# Altium project NAVIGATION.PrjPcb (part 1 of 2)
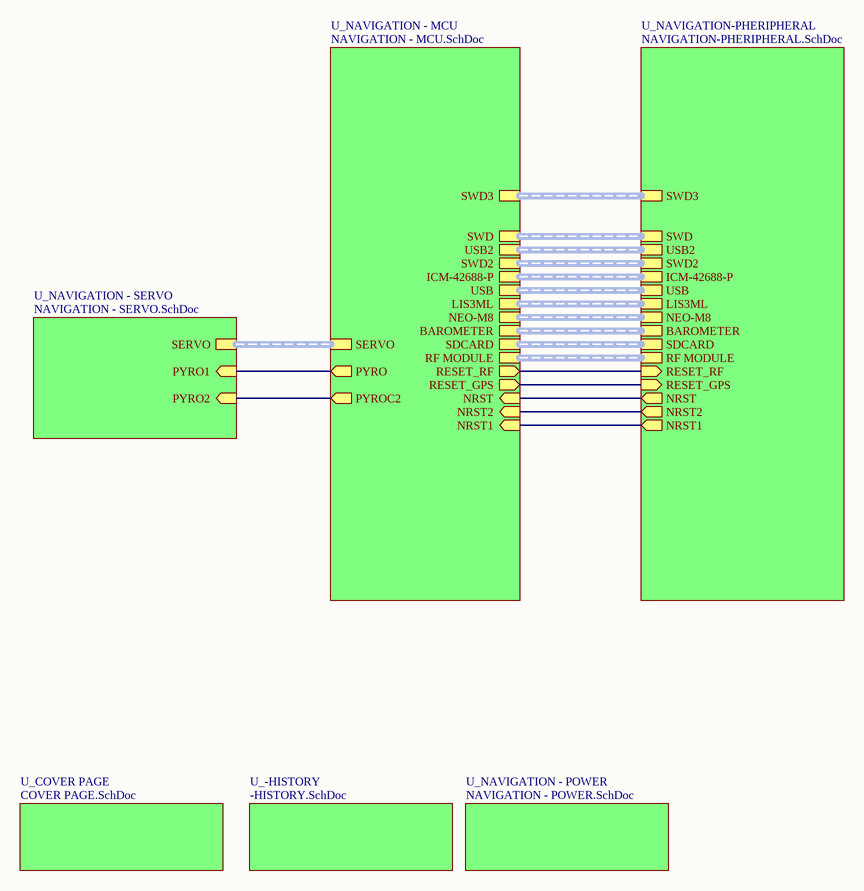
[diagram p0: OVERVIEW.SchDoc]
7 sheets, 251 parts. Net scope: hierarchical (ports join the sheet entries above them; power ports are global).
Board file: NAVIGATION.PcbDoc
Sheets:
  OVERVIEW.SchDoc
    U_COVER PAGE = COVER PAGE.SchDoc
    U_NAVIGATION - POWER = NAVIGATION - POWER.SchDoc
    U_NAVIGATION - MCU = NAVIGATION - MCU.SchDoc
    U_-HISTORY = -HISTORY.SchDoc
    U_NAVIGATION-PHERIPHERAL = NAVIGATION-PHERIPHERAL.SchDoc
    U_NAVIGATION - SERVO = NAVIGATION - SERVO.SchDoc

## Sheet OVERVIEW.SchDoc
size A4; SheetNumber: 1; SheetTotal: 7

### Sub-sheets
U_-HISTORY = -HISTORY.SchDoc: no entries
U_COVER PAGE = COVER PAGE.SchDoc: no entries
U_NAVIGATION - MCU = NAVIGATION - MCU.SchDoc: SWD (harness JTAG), USB2 (harness USB2), SWD2 (harness JTAG2), ICM-42688-P (harness ICM-42688-P), USB (harness USB), LIS3ML (harness LIS3ML), NEO-M8 (harness NEO-M8), BAROMETER (harness BAROMETER), SDCARD (harness SDCARD), RF MODULE (harness RF MODULE), SERVO (harness SERVO), RESET_RF (out), RESET_GPS (out), NRST (in), SWD3 (harness JTAG3), NRST1 (in), NRST2 (in), PYRO (out), PYROC2 (out)
U_NAVIGATION - POWER = NAVIGATION - POWER.SchDoc: no entries
U_NAVIGATION - SERVO = NAVIGATION - SERVO.SchDoc: SERVO (harness SERVO), PYRO1 (in), PYRO2 (in)
U_NAVIGATION-PHERIPHERAL = NAVIGATION-PHERIPHERAL.SchDoc: NRST (out), USB (harness USB), RF MODULE (harness RF MODULE), USB2 (harness USB2), BAROMETER (harness BAROMETER), SDCARD (harness SDCARD), RESET_GPS (in), ICM-42688-P (harness ICM-42688-P), RESET_RF (in), SWD2 (harness JTAG2), LIS3ML (harness LIS3ML), SWD (harness JTAG), NEO-M8 (harness NEO-M8), NRST2 (out), SWD3 (harness JTAG2), NRST1 (out)

### Nets
NRST: sheet U_NAVIGATION - MCU/NRST, sheet U_NAVIGATION-PHERIPHERAL/NRST
NRST1: sheet U_NAVIGATION - MCU/NRST1, sheet U_NAVIGATION-PHERIPHERAL/NRST1
NRST2: sheet U_NAVIGATION - MCU/NRST2, sheet U_NAVIGATION-PHERIPHERAL/NRST2
PYRO: sheet U_NAVIGATION - MCU/PYRO, sheet U_NAVIGATION - SERVO/PYRO1
PYROC2: sheet U_NAVIGATION - MCU/PYROC2, sheet U_NAVIGATION - SERVO/PYRO2
NetR76_1: sheet U_NAVIGATION - MCU/RESET_GPS, sheet U_NAVIGATION-PHERIPHERAL/RESET_GPS
NetR78_1: sheet U_NAVIGATION - MCU/RESET_RF, sheet U_NAVIGATION-PHERIPHERAL/RESET_RF

### Buses and harness runs
harness sheet U_NAVIGATION - MCU/BAROMETER = sheet U_NAVIGATION-PHERIPHERAL/BAROMETER
harness sheet U_NAVIGATION - MCU/ICM-42688-P = sheet U_NAVIGATION-PHERIPHERAL/ICM-42688-P
harness sheet U_NAVIGATION - MCU/LIS3ML = sheet U_NAVIGATION-PHERIPHERAL/LIS3ML
harness sheet U_NAVIGATION - MCU/NEO-M8 = sheet U_NAVIGATION-PHERIPHERAL/NEO-M8
harness sheet U_NAVIGATION - MCU/RF MODULE = sheet U_NAVIGATION-PHERIPHERAL/RF MODULE
harness sheet U_NAVIGATION - MCU/SDCARD = sheet U_NAVIGATION-PHERIPHERAL/SDCARD
harness sheet U_NAVIGATION - MCU/SERVO = sheet U_NAVIGATION - SERVO/SERVO
harness sheet U_NAVIGATION - MCU/SWD2 = sheet U_NAVIGATION-PHERIPHERAL/SWD2
harness sheet U_NAVIGATION - MCU/SWD3 = sheet U_NAVIGATION-PHERIPHERAL/SWD3
harness sheet U_NAVIGATION - MCU/SWD = sheet U_NAVIGATION-PHERIPHERAL/SWD
harness sheet U_NAVIGATION - MCU/USB2 = sheet U_NAVIGATION-PHERIPHERAL/USB2
harness sheet U_NAVIGATION - MCU/USB = sheet U_NAVIGATION-PHERIPHERAL/USB

## Sheet COVER PAGE.SchDoc
size A3; SheetNumber: 2; SheetTotal: 5
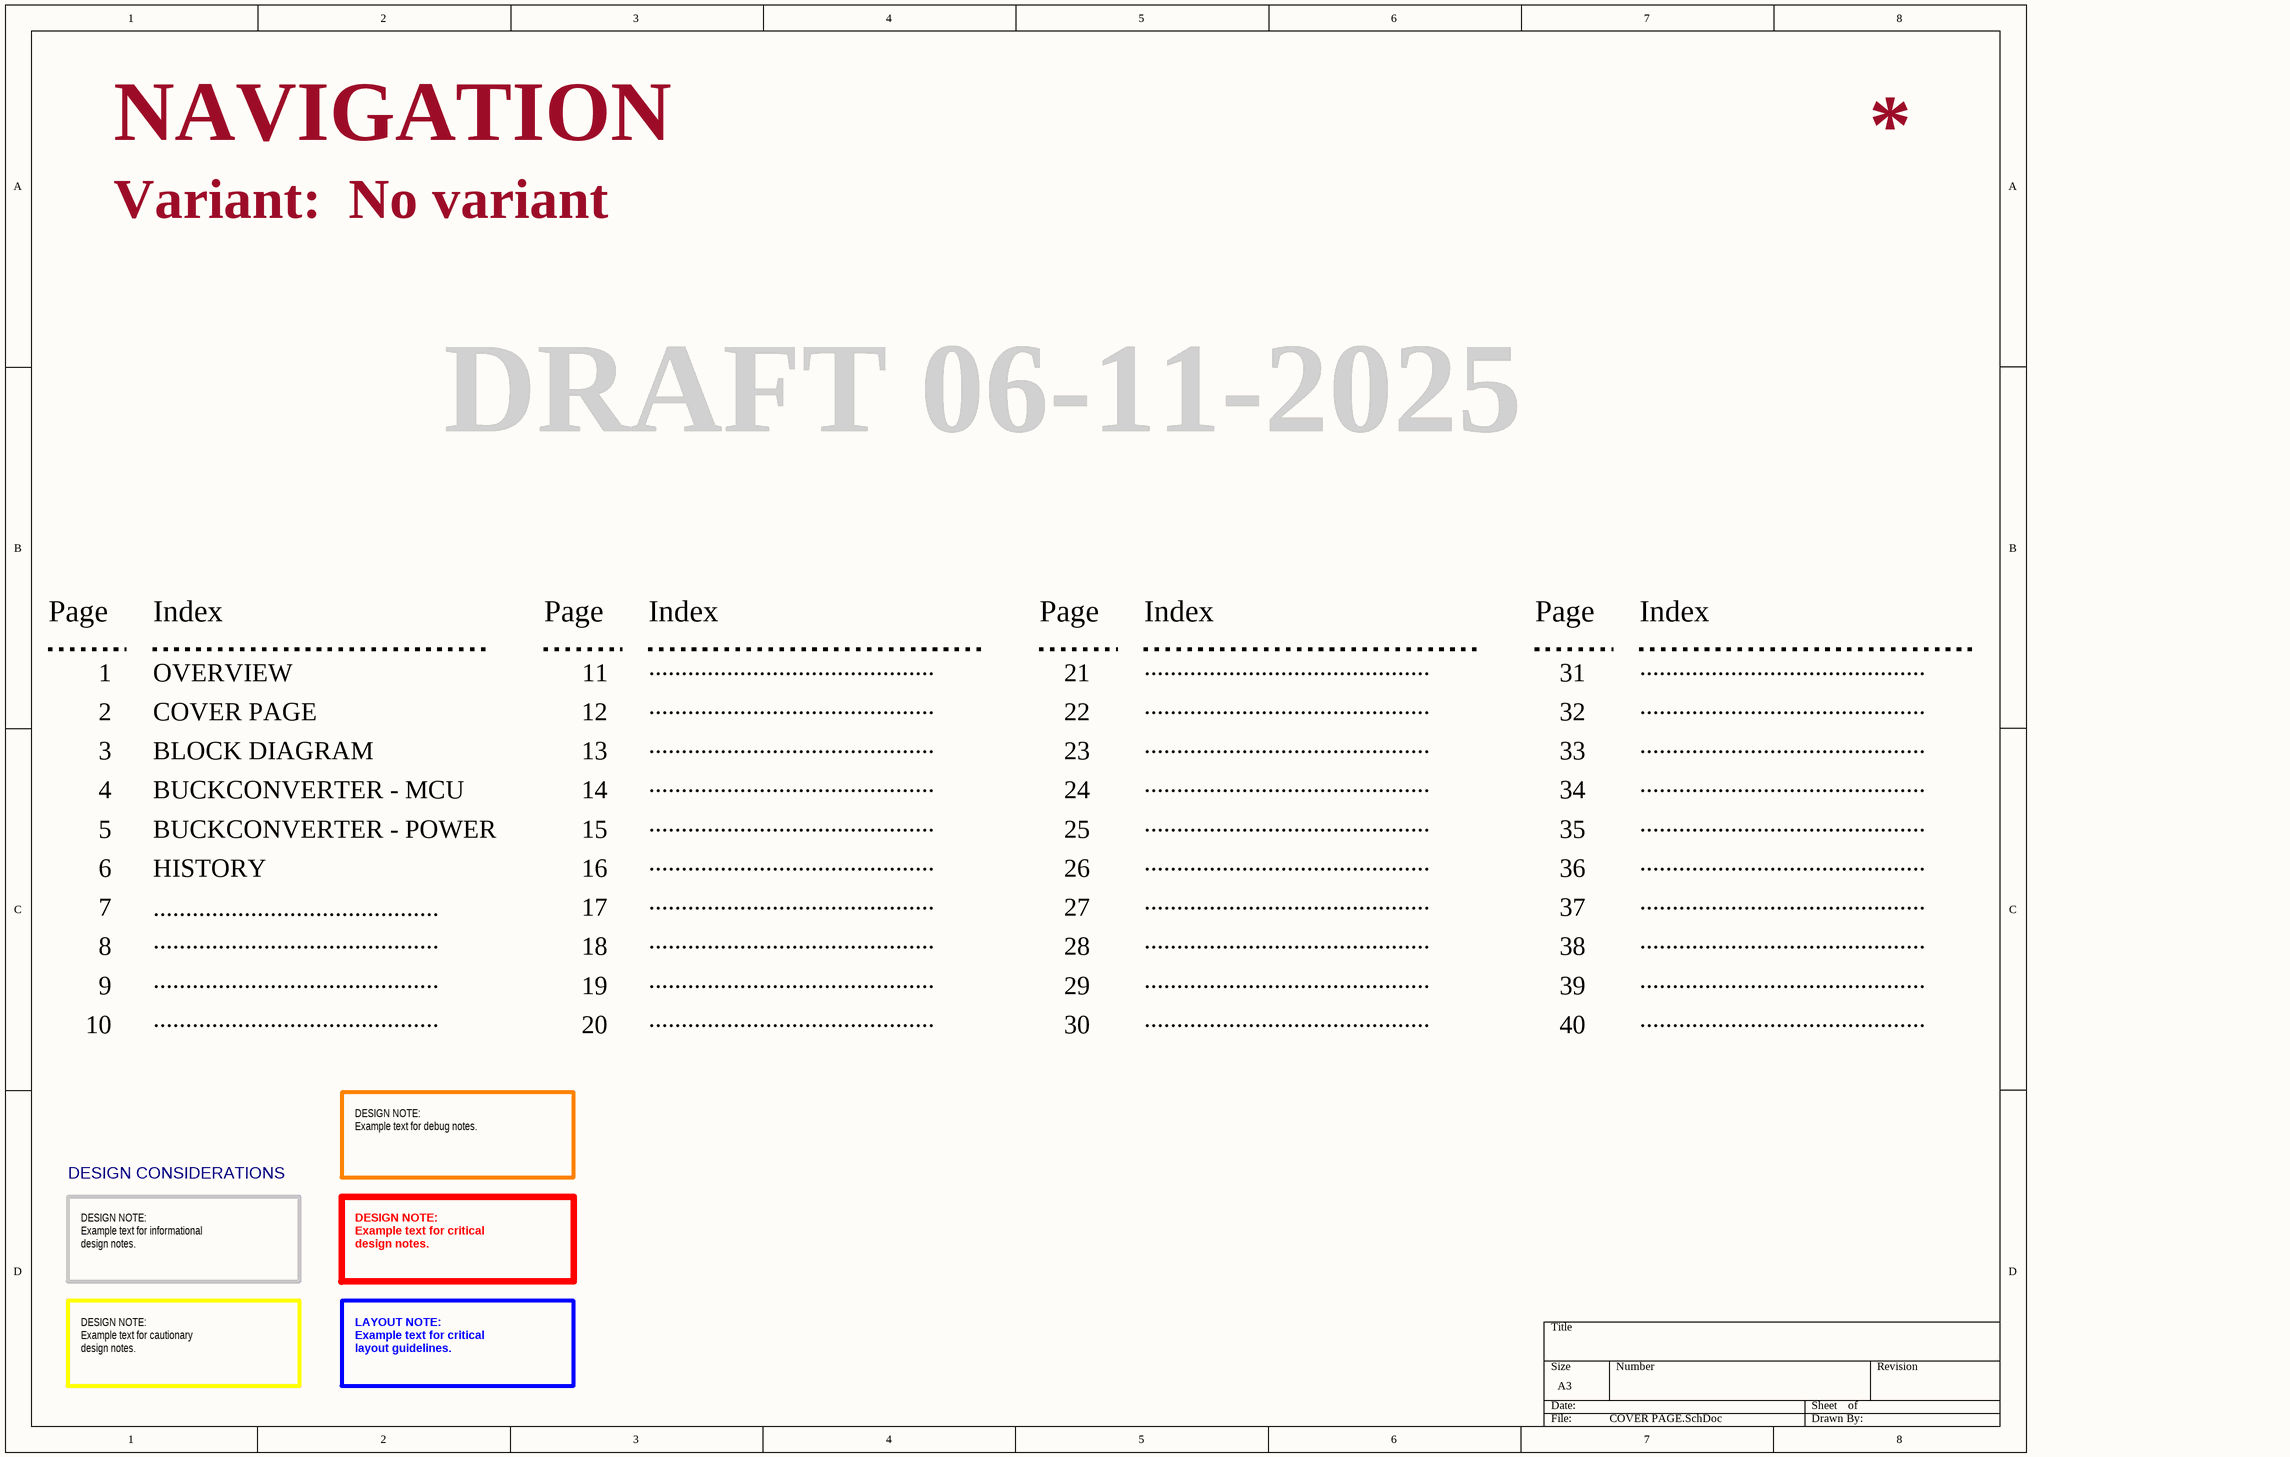
[diagram p1: COVER PAGE.SchDoc]

### Notes on the sheet
- NAVIGATION
- Variant:
- No variant
- DRAFT 06-11-2025
- Page
- Index
- 1
- OVERVIEW
- 11
- ............................................
- 21
- 31
- 2
- 3
- COVER PAGE
- BLOCK DIAGRAM
- 12
- 13
- 22
- 23
- 32
- 33
- 4
- BUCKCONVERTER - MCU
- 14
- 24
- 34
- 5
- 6
- BUCKCONVERTER - POWER
- HISTORY
- 15
- 16
- 25
- 26
- 35
- 36
- 7
- 8
- 17
- 18
- 27
- 28
- 37
- 38
- 9
- 19
- 29
- 39
- 10
- 20
- 30
- 40
- DESIGN CONSIDERATIONS
- DESIGN NOTE:
  Example text for debug notes.
- DESIGN NOTE:
  Example text for informational
  design notes.
- DESIGN NOTE:
  Example text for critical
  design notes.
- DESIGN NOTE:
  Example text for cautionary
  design notes.
- LAYOUT NOTE:
  Example text for critical
  layout guidelines.

## Sheet NAVIGATION - POWER.SchDoc
size A4; SheetNumber: 3; SheetTotal: 7
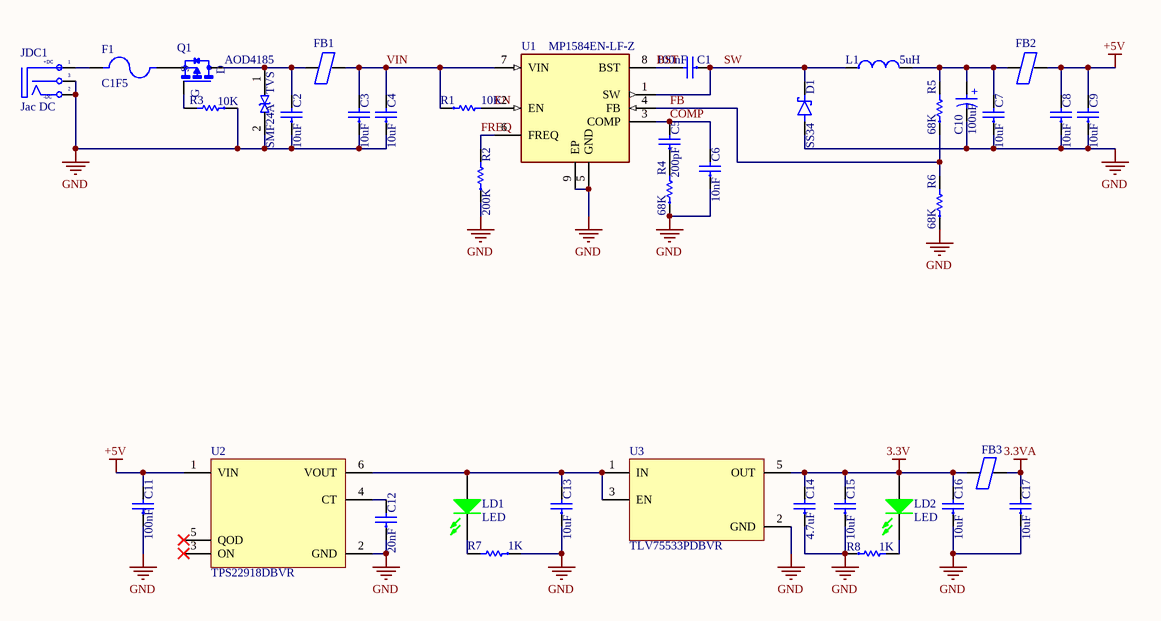
[diagram p2: NAVIGATION - POWER.SchDoc]

### Parts
C1  100nF  [CAP-CER0402-0.5H]
C2  10uF  [CAP-CER0402-20mil]
C3  10uF  [CAP-CER0402-20mil]
C4  10uF  [CAP-CER0402-20mil]
C5  200pF  [CAP-CER0402-0.5H]
C6  10nF  [CAP-CER0402-0.5H]
C7  10uF  [CAP-CER0402-20mil]
C8  10uF  [CAP-CER0402-20mil]
C9  10uF  [CAP-CER0402-20mil]
C10  100uF  [Cap Aluminum Lytic 100uF 35V 20%]
C11  100nF  [CAP-CER0402-20mil]
C12  20nF  [CAP-CER0402-20mil]
C13  10uF  [CAP-CER0402-20mil]
C14  4.7uF  [CAP-CER0402-20mil]
C15  10uF  [CAP-CER0402-20mil]
C16  10uF  [CAP-CER0402-20mil]
C17  10uF  [CAP-CER0402-20mil]
D1  SS34  [DIO_SS34]
F1  C1F5  [FUSE C1F5]
FB1  100MHz 2A 50mOhm  [FB 0603]  (value not drawn)
FB2  100MHz 2A 50mOhm  [FB 0603]  (value not drawn)
FB3  100MHz 2A 50mOhm  [FB 0603]  (value not drawn)
JDC1  Jac DC  [DC0]
L1  5uH  [IND-06030-1uH]
LD1  LED  [LED-IND0402-GRE-0.4H]
LD2  LED  [LED-IND0402-GRE-0.4H]
Q1  AOD4185  [AOD4185]
R1  10K  [RES-CHP0402-0.35H]
R2  200K  [RES-CHP0402-0.35H]
R3  10K  [RES-CHP0402-0.35H]
R4  68K  [RES-CHP0402-0.35H]
R5  68K  [RES-CHP0402-0.35H]
R6  68K  [RES-CHP0402-0.35H]
R7  1K  [RES-CHP0402-0.35H]
R8  1K  [RES-CHP0402-0.35H]
TVS  SMF24A  [TVS24V]
U1  MP1584EN-LF-Z  [SOIC127P600X170-9N]
U2  TPS22918DBVR  [SOT95P280X145-6N]
U3  TLV75533PDBVR  [SOT95P280X145-5N]

### Nets
3.3V: C14.2 C15.2 C16.2 FB3.1 LD2.1(A) U3.5(OUT)
3.3VA: C17.2 FB3.2
+5V: C8.2 C9.2 C11.2 FB2.2 U2.1(VIN)
GND: C2.1 C3.1 C4.1 C6.1 C7.1 C8.1 C9.1 C10.2(N) C11.1 C12.1 C13.1 C14.1 C15.1 C16.1 C17.1 D1.A JDC1.2(TN) JDC1.3(S) R2.1 R3.1 R4.1 R6.1 R7.1 R8.1 TVS.2 U1.5(GND) U1.9(EP) U2.2(GND) U3.2(GND)
BST: C1.2 U1.8(BST)
COMP: C5.2 C6.2 U1.3(COMP)
EN: R1.2 U1.2(EN)
FB: R5.1 R6.2 U1.4(FB)
FREQ: R2.2 U1.6(FREQ)
SW: C1.1 D1.C(K) L1.1 U1.1(SW)
VIN: C3.2 C4.2 FB1.2 R1.1 U1.7(VIN)
NetC2_2: C2.2 FB1.1 Q1.4(D) TVS.1
NetC5_1: C5.1 R4.2
NetC7_2: C7.2 C10.1(P) FB2.1 L1.2 R5.2
NetC12_2: C12.2 U2.4(CT)
NetC13_2: C13.2 LD1.1(A) U2.6(VOUT) U3.1(IN) U3.3(EN)
NetF1_1: F1.1 JDC1.1(T)
NetF1_2: F1.2 Q1.3(S)
NetLD1_2: LD1.2(K) R7.2
NetLD2_2: LD2.2(K) R8.2
NetQ1_1: Q1.1(G) R3.2

Not connected (* = marked no-connect by the designer): U2 3(ON)* 5(QOD)*

### Notes on the sheet
- (in symbol Cap Aluminum Lytic 100uF 35V 20%) +
- (in symbol DCIN) +DC; -DC

### Library data of the parts
C1 = CAPCER0013 100nF 10% 50V X7R 0402 SMD: CAP CER 100nF 10% 50V X7R 0402 SMD; LINE: SMT; TYPE: EP; UNIT: PCS; TMG CODE: None; CERTIFICATION: NA; CLASS: B; MOUNT: SMD; TMG PN: CAPCER0013; ComponentLink1Description: Datasheet; ComponentLink1URL: https://datasheet.lcsc.com/lcsc/1811021431_Samsung-Electro-Mechanics-CL10B104KB8NNNC_C1591.pdf; Footprint: 0402
C2-C4 C7-C9 C11-C17 = CAPCER0040 10uF 20% 6.3V X5R 0402 SMD: CAP CER 10uF 20% 6.3V X5R 0402 SMD; LINE: SMT; TYPE: EP; UNIT: PCS; TMG PN: CAPCER0013; TMG CODE: None; CERTIFICATION: NA; CLASS: B; MOUNT: SMD; ComponentLink1Description: Datasheet; ComponentLink1URL: https://datasheet.lcsc.com/lcsc/2304140030_YAGEO-CC0402MRX5R5BB106_C105884.pdf; Footprint: 0402
C5 C6 = CAPCER0045 10nF 10% 25V X7R 0402 SMD: CAP CER 10nF 10% 25V X7R 0402 SMD; LINE: SMT; TYPE: EP; UNIT: PCS; TMG CODE: None; CERTIFICATION: NA; CLASS: B; MOUNT: SMD; ComponentLink1Description: Datasheet; ComponentLink1URL: https://datasheet.lcsc.com/lcsc/1811141228_YAGEO-CC0402KRX7R8BB103_C327025.pdf
C10 = Cap Aluminum Lytic 100uF 35V 20%: Cap Aluminum Lytic 100uF 35V 20% (6.3 X 7.7mm) SMD 300mA 2000h 105C T/R; Manufacturer: Wurth Electronics; Manufacturer Part Number: 865080545012; Dissipation Factor: 14%; ESR (Equivalent Series Resistance): 321.392mR; Insulation Resistance: 1MR; Leakage Current: 35uA; Supplier 1: Digikey; RoHS: Yes; Category: Aluminum Electrolytic Capacitors; Stock 1: 37792; Pricing 1: 1=0.31, 50=0.2674, 100=0.2322, 250=0.207, 900=0.1809, 1800=0.1719 (USD); Ripple Current: 300mA; Voltage Rating (DC): 35V; Length: 7.7mm; Width: 6.6mm; ComponentLink1URL: http://www.farnell.com/datasheets/1880164.pdf?src-supplier=Farnell; ComponentLink1Description: http://www.farnell.com/datasheets/1880164.pdf?src-supplier=Farnell; ComponentLink2URL: http://www.farnell.com/datasheets/1880164.pdf?src-supplier=Newark; ComponentLink2Description: http://www.farnell.com/datasheets/1880164.pdf?src-supplier=Newark; ComponentLink3URL: https://katalog.we-online.de/pbs/datasheet/865080545012.pdf?src-supplier=Digikey; ComponentLink3Description: https://katalog.we-online.de/pbs/datasheet/865080545012.pdf?src-supplier=Digikey; ComponentLink4URL: http://www.farnell.com/datasheets/1880164.pdf?src-supplier=Element14; ComponentLink4Description: http://www.farnell.com/datasheets/1880164.pdf?src-supplier=Element14; Supplier Part Number 1: 732-8511-1-ND
D1 = SS34: 3A, 40V, Schottky Rectifier; MF: Taiwan Semiconductor; SnapEDA_Link: https://www.snapeda.com/parts/SS34/Taiwan+Semiconductor/view-part/?ref=snap; Package: DO-214AB-2 Taiwan Semiconductor; Value: *; MP: SS34; Check_prices: https://www.snapeda.com/parts/SS34/Taiwan+Semiconductor/view-part/?ref=eda
F1 = C1F5: Fuse Chip Fast Acting 5A 125V SMD Solder Pad 1206 3.2 X 1.58 X 0.63mm; Manufacturer: Bel TRP; Voltage Rating (DC): 63V; DC Cold Resistance: 20mR; Fuse Type: Board Mount (Cartridge Style Excluded); Supplier 1: Newark; Manufacturer Part Number: C1F5; RoHS: Yes; Category: Uncategorized; Mount: Surface Mount; Case/Package: 1206; Number of Pins: 2; Contact Plating: Tin; Case Code (Metric): 3216; Case Code (Imperial): 1206; Min Operating Temperature: -55°C; Max Operating Temperature: 125°C; Packaging: Cut Tape; Voltage Rating: 125V; Series: C1F; Voltage Rating (AC): 125V; ComponentLink1URL: http://www.mouser.com/ds/2/643/C1F-594910.pdf?src-supplier=Mouser; ComponentLink1Description: http://www.mouser.com/ds/2/643/C1F-594910.pdf?src-supplier=Mouser; ComponentLink2URL: http://belfuse.com/pdfs/C1F.pdf?src-supplier=Avnet; ComponentLink2Description: http://belfuse.com/pdfs/C1F.pdf?src-supplier=Avnet; ComponentLink3URL: https://belfuse.com/resources/datasheets/circuitprotection/ds-cp-c1f-series.pdf?src-supplier=Digikey; ComponentLink3Description: https://belfuse.com/resources/datasheets/circuitprotection/ds-cp-c1f-series.pdf?src-supplier=Digikey; Supplier Part Number 1: 48AC8480
FB1-FB3 = BLM18PG121SN1D: Ferrite Beads Multi-Layer 120Ohm 25% 100MHz 2A 50mOhm DCR 0603 Paper T/R; Manufacturer: Murata; Material: Steel,Ferrite; Impedance: 120R; Number of Lines: 1; DC Resistance (DCR): 50mR; Number of Circuits: 1NUMBER; Shielding: 202Shielding; Supplier 1: Mouser; Manufacturer Part Number: BLM18PG121SN1D; RoHS: Yes; Category: Ferrite Beads and Chips; Stock 1: 377848; Pricing 1: 1=0.1, 10=0.059, 50=0.047, 100=0.042, 1000=0.029, 10000=0.018 (USD); Case/Package: 0603; Number of Pins: 2; Core Material: Ferrite; Case Code (Metric): 1608; Case Code (Imperial): 0603; Min Operating Temperature: -55°C; Max Operating Temperature: 125°C; Tolerance: 25%; Package Quantity: 1; Max Current Rating: 2A; Packaging: Tape and Reel; Current Rating: 2A; Max DC Current: 2A; Termination: SMD/SMT; Test Frequency: 100MHz; DC Current: 2A; Frequency: 100MHz; Series: BLM18P; DC Resistance-Max: 50mR; RMS Current (Irms): 2A; Series Resistance: 50mR; Length: 1.6mm; Width: 0.8mm; Height: 0.8mm; Depth: 0.8mm; Radiation Hardening: No; Reach SVHC Compliant: No; Lead Free: Lead Free; RoHS Compliant: Yes; ComponentLink1URL: https://datasheet.ciiva.com/5709/1740433-5709171.pdf?src-supplier=Farnell; ComponentLink1Description: https://datasheet.ciiva.com/5709/1740433-5709171.pdf?src-supplier=Farnell; ComponentLink2URL: https://datasheet.ciiva.com/19454/1845013-19454715.pdf?src-supplier=Jameco; ComponentLink2Description: https://datasheet.ciiva.com/19454/1845013-19454715.pdf?src-supplier=Jameco; ComponentLink3URL: https://datasheet.ciiva.com/11799/0900766b81275ca5-11799546.pdf?src-supplier=Rs; ComponentLink3Description: https://datasheet.ciiva.com/11799/0900766b81275ca5-11799546.pdf?src-supplier=Rs; ComponentLink4URL: https://datasheet.ciiva.com/3854/5emiapbde-1-3854039.pdf?src-supplier=Arrow+Electronics; ComponentLink4Description: https://datasheet.ciiva.com/3854/5emiapbde-1-3854039.pdf?src-supplier=Arrow+Electronics; ComponentLink5URL: https://datasheet.ciiva.com/29347/442365-da-01-en-chip-drossel-0603-120r-2000ma-1-6x0-8mm-29347911.pdf?src-supplier=Conrad; ComponentLink5Description: https://datasheet.ciiva.com/29347/442365-da-01-en-chip-drossel-0603-120r-2000ma-1-6x0-8mm-29347911.pdf?src-supplier=Conrad; ComponentLink6URL: https://datasheet.ciiva.com/8021/1740433-8021493.pdf?src-supplier=Element14; ComponentLink6Description: https://datasheet.ciiva.com/8021/1740433-8021493.pdf?src-supplier=Element14; ComponentLink7URL: https://datasheet.ciiva.com/8021/1740433-8021494.pdf?src-supplier=Element14; ComponentLink7Description: https://datasheet.ciiva.com/8021/1740433-8021494.pdf?src-supplier=Element14; ComponentLink8URL: https://datasheet.ciiva.com/14122/blm-series-eng-tds-14122905.pdf?src-supplier=Distrelec; ComponentLink8Description: https://datasheet.ciiva.com/14122/blm-series-eng-tds-14122905.pdf?src-supplier=Distrelec; ComponentLink9URL: https://datasheet.ciiva.com/6212/l0110s0100blm18p-6212502.pdf?src-supplier=Digikey; ComponentLink9Description: https://datasheet.ciiva.com/6212/l0110s0100blm18p-6212502.pdf?src-supplier=Digikey; ComponentLink10URL: https://datasheet.ciiva.com/6212/l0110s0100blm18p-6212504.pdf?src-supplier=Digikey; ComponentLink10Description: https://datasheet.ciiva.com/6212/l0110s0100blm18p-6212504.pdf?src-supplier=Digikey; ComponentLink11URL: https://datasheet.ciiva.com/3081/l0110s0100blm18p-3081632.pdf?src-supplier=Avnet; ComponentLink11Description: https://datasheet.ciiva.com/3081/l0110s0100blm18p-3081632.pdf?src-supplier=Avnet; ComponentLink12URL: https://datasheet.ciiva.com/41449/001172297-da-01-en-drossel-0603-120r-1-6x0-8mm-4000st-41449659.pdf?src-supplier=Conrad; ComponentLink12Description: https://datasheet.ciiva.com/41449/001172297-da-01-en-drossel-0603-120r-1-6x0-8mm-4000st-41449659.pdf?src-supplier=Conrad; Supplier Part Number 1: 81-BLM18PG121SN1D
JDC1 = DCIN: Jac DC input; Value: Jac DC
L1 = INDMOI0013 1W2T 1.5uH 20% 14A 0630 SMD: IND MOI 1W2T 1.5uH 20% 14A 0630 SMD; LINE: SMT; TYPE: EP; UNIT: PCS; TMG CODE: None; CERTIFICATION: NA; CLASS: B; MOUNT: SMD; ComponentLink1Description: Datasheet; ComponentLink1URL: https://datasheet.lcsc.com/lcsc/2210101130_SHOU-HAN-CYA0630-1-5UH_C5189745.pdf
LD1 LD2 = LEDIND0005 GRE CLR 2.4V 20mA 0402 SMD: LED IND GRE CLR 2.4V 20mA 0402 SMD; LINE: SMT; TYPE: EP; UNIT: PCS; TMG CODE: None; CERTIFICATION: NA; CLASS: B; MOUNT: SMD; ComponentLink1Description: Datasheet; ComponentLink1URL: https://datasheet.lcsc.com/lcsc/2102221739_Yongyu-Photoelectric-SZYY0402YG_C434449.pdf
Q1 = AOD4185: Trans MOSFET P-CH 40V 40A 3-Pin(2+Tab) DPAK; Manufacturer: Alpha & Omega Semiconductor; Supplier 1: Digikey; Manufacturer Part Number: AOD4185; RoHS: Yes; Category: Transistors; Stock 1: 1666; Pricing 1: 1=1.22, 10=0.766, 100=0.5048, 500=0.3923, 1000=0.35608 (USD); ComponentLink1URL: https://datasheet.ciiva.com/951/aod4185-951090.pdf?src-supplier=Digikey; ComponentLink1Description: https://datasheet.ciiva.com/951/aod4185-951090.pdf?src-supplier=Digikey; ComponentLink2URL: https://datasheet.ciiva.com/6384/aod4185-6384890.pdf?src-supplier=Digikey; ComponentLink2Description: https://datasheet.ciiva.com/6384/aod4185-6384890.pdf?src-supplier=Digikey; ComponentLink3URL: https://datasheet.ciiva.com/6384/aod4185-6384893.pdf?src-supplier=Digikey; ComponentLink3Description: https://datasheet.ciiva.com/6384/aod4185-6384893.pdf?src-supplier=Digikey; Supplier Part Number 1: 785-1222-1-ND
R1 = RESCHP0073 10K 1% 0402 SMD: RES CHP 10K 1% 1/16W 0402 SMD; LINE: SMT; UNIT: PCS; TMG CODE: None; CERTIFICATION: NA; CLASS: B; MOUNT: SMD; TYPE: EP; TMG PN: RESCHP0073; ComponentLink1Description: Datasheet; ComponentLink1URL: https://datasheet.lcsc.com/lcsc/2304140030_YAGEO-AC0402FR-0710KL_C144807.pdf; Footprint: 0402
R2-R8 = RESCHP0097 100K 1% 0402 SMD: RES CHP 100K 1% 1/16W 0402 SMD; LINE: SMT; UNIT: PCS; TMG CODE: None; CERTIFICATION: NA; CLASS: B; MOUNT: SMD; TYPE: EP; ComponentLink1Description: Datasheet; ComponentLink1URL: https://datasheet.lcsc.com/lcsc/2304140030_YAGEO-AC0402FR-0710KL_C144807.pdf
TVS = SMF24A: TVS DIODE 24VWM 38.9VC SOD123F; Manufacturer: Littelfuse; Supplier 1: Digikey; Manufacturer Part Number: SMF24A; RoHS: Yes; Category: TVS Diodes; Stock 1: 51545; Pricing 1: 1=0.28, 10=0.225, 100=0.114, 500=0.111, 1000=0.108 (USD); ComponentLink1URL: https://datasheet.ciiva.com/6578/littelfuse-tvs-diode-smf-datasheet-pdf-6578345.pdf?src-supplier=Digikey; ComponentLink1Description: https://datasheet.ciiva.com/6578/littelfuse-tvs-diode-smf-datasheet-pdf-6578345.pdf?src-supplier=Digikey; ComponentLink2URL: https://datasheet.ciiva.com/6578/littelfuse-tvs-diode-smf-datasheet-pdf-6578346.pdf?src-supplier=Digikey; ComponentLink2Description: https://datasheet.ciiva.com/6578/littelfuse-tvs-diode-smf-datasheet-pdf-6578346.pdf?src-supplier=Digikey; ComponentLink3URL: https://datasheet.ciiva.com/6578/littelfuse-tvs-diode-smf-datasheet-pdf-6578347.pdf?src-supplier=Digikey; ComponentLink3Description: https://datasheet.ciiva.com/6578/littelfuse-tvs-diode-smf-datasheet-pdf-6578347.pdf?src-supplier=Digikey; Supplier Part Number 1: F5823CT-ND
U1 = MP1584EN-LF-Z: Buck Switching Regulator IC Positive Adjustable 0.8V 1 Output 3A 8-SOIC (0.154, 3.90mm Width) Exposed Pad; MF: Monolithic Power Systems; MP: MP1584ENLFZ; SnapEDA_Link: https://www.snapeda.com/parts/MP1584ENLFZ/Monolithic+Power+Systems/view-part/?ref=snap; Package: SOIC-8 Monolithic Power Systems; Value: *; Check_prices: https://www.snapeda.com/parts/MP1584ENLFZ/Monolithic+Power+Systems/view-part/?ref=eda
U2 = TPS22918DBVR: 5.5-V, 2-A, 52-mÎ© load switch with adj. rise time and adj. output discharge; MF: Texas Instruments; SnapEDA_Link: https://www.snapeda.com/parts/TPS22918DBVR/Texas+Instruments/view-part/?ref=snap; Package: SOT-23-6 Texas Instruments; Value: *; MP: TPS22918DBVR; Check_prices: https://www.snapeda.com/parts/TPS22918DBVR/Texas+Instruments/view-part/?ref=eda
U3 = TLV75533PDBVR: 500-mA High-PSRR Low-IQ-Tief-Dropout-Spannungsregler mitablem; MF: Texas Instruments; SnapEDA_Link: https://www.snapeda.com/parts/TLV75533PDBVR/Texas+Instruments/view-part/?ref=snap; Package: SOT-23-5 Texas Instruments; Value: *; MP: TLV75533PDBVR; Check_prices: https://www.snapeda.com/parts/TLV75533PDBVR/Texas+Instruments/view-part/?ref=eda

## Sheet NAVIGATION - MCU.SchDoc
size A2; SheetNumber: 6; SheetTotal: 7
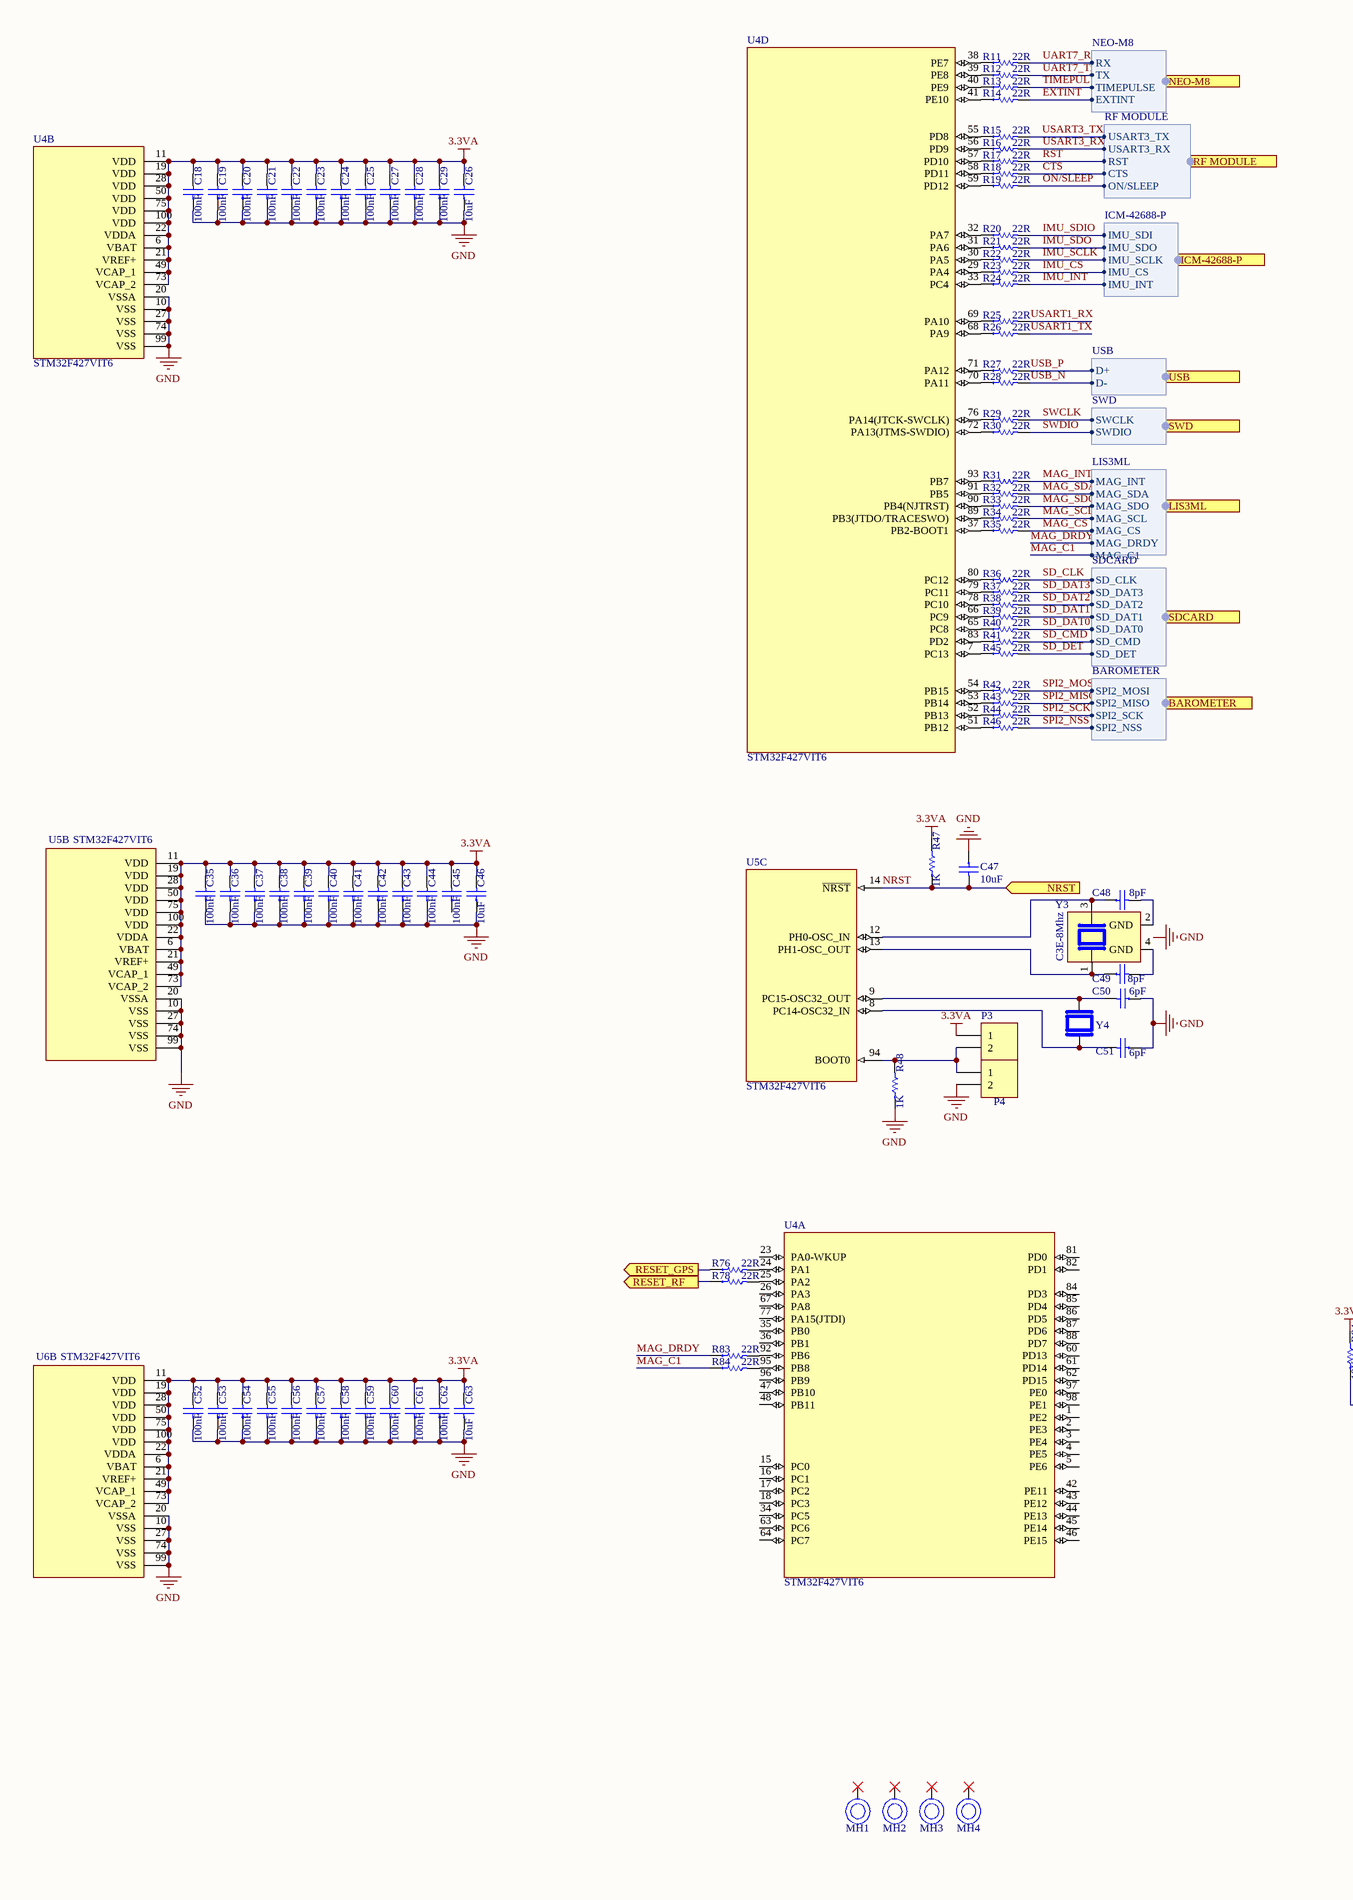
[diagram p3: NAVIGATION - MCU.SchDoc, left]
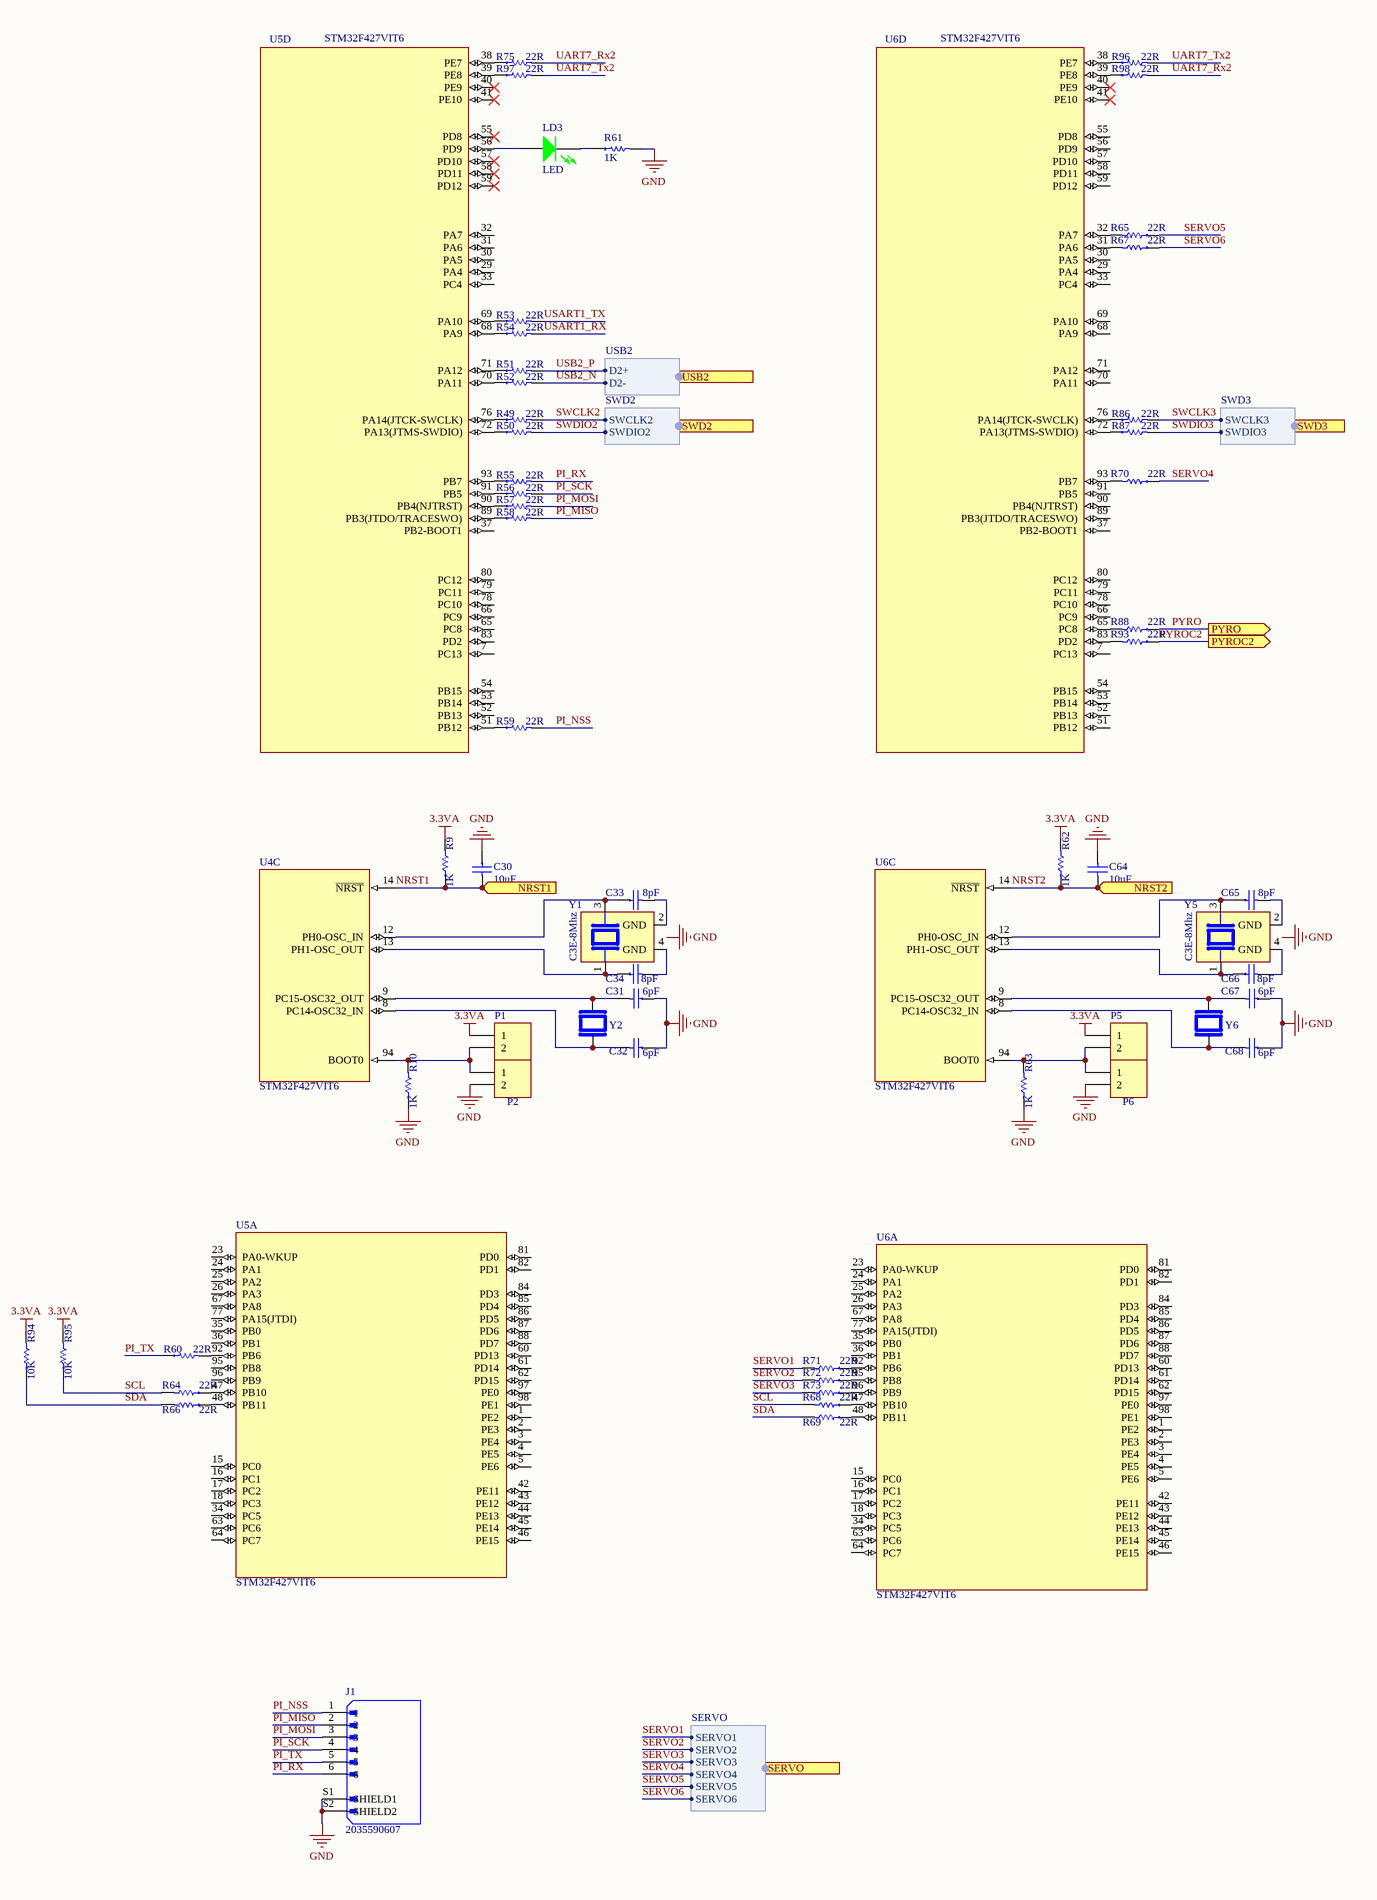
[diagram p4: NAVIGATION - MCU.SchDoc, right]

### Parts
C18  100nF  [CAP-CER0402-0.5H]
C19  100nF  [CAP-CER0402-0.5H]
C20  100nF  [CAP-CER0402-0.5H]
C21  100nF  [CAP-CER0402-0.5H]
C22  100nF  [CAP-CER0402-0.5H]
C23  100nF  [CAP-CER0402-0.5H]
C24  100nF  [CAP-CER0402-0.5H]
C25  100nF  [CAP-CER0402-0.5H]
C26  10uF  [CAP-CER0402-20mil]
C27  100nF  [CAP-CER0402-0.5H]
C28  100nF  [CAP-CER0402-0.5H]
C29  100nF  [CAP-CER0402-0.5H]
C30  10uF  [CAP-CER0402-20mil]
C31  6pF  [CAP-CER0402-0.5H]
C32  6pF  [CAP-CER0402-0.5H]
C33  8pF  [CAP-CER0402-0.5H]
C34  8pF  [CAP-CER0402-0.5H]
C35  100nF  [CAP-CER0402-0.5H]
C36  100nF  [CAP-CER0402-0.5H]
C37  100nF  [CAP-CER0402-0.5H]
C38  100nF  [CAP-CER0402-0.5H]
C39  100nF  [CAP-CER0402-0.5H]
C40  100nF  [CAP-CER0402-0.5H]
C41  100nF  [CAP-CER0402-0.5H]
C42  100nF  [CAP-CER0402-0.5H]
C43  100nF  [CAP-CER0402-0.5H]
C44  100nF  [CAP-CER0402-0.5H]
C45  100nF  [CAP-CER0402-0.5H]
C46  10uF  [CAP-CER0402-20mil]
C47  10uF  [CAP-CER0402-20mil]
C48  8pF  [CAP-CER0402-0.5H]
C49  8pF  [CAP-CER0402-0.5H]
C50  6pF  [CAP-CER0402-0.5H]
C51  6pF  [CAP-CER0402-0.5H]
C52  100nF  [CAP-CER0402-0.5H]
C53  100nF  [CAP-CER0402-0.5H]
C54  100nF  [CAP-CER0402-0.5H]
C55  100nF  [CAP-CER0402-0.5H]
C56  100nF  [CAP-CER0402-0.5H]
C57  100nF  [CAP-CER0402-0.5H]
C58  100nF  [CAP-CER0402-0.5H]
C59  100nF  [CAP-CER0402-0.5H]
C60  100nF  [CAP-CER0402-0.5H]
C61  100nF  [CAP-CER0402-0.5H]
C62  100nF  [CAP-CER0402-0.5H]
C63  10uF  [CAP-CER0402-20mil]
C64  10uF  [CAP-CER0402-20mil]
C65  8pF  [CAP-CER0402-0.5H]
C66  8pF  [CAP-CER0402-0.5H]
C67  6pF  [CAP-CER0402-0.5H]
C68  6pF  [CAP-CER0402-0.5H]
J1  2035590607  [MOLEX_2035590607]
LD3  LED  [LED-IND0402-GRE-0.4H]
MH1  MOUNTING HOLE  [M3]  (value not drawn)
MH2  MOUNTING HOLE  [M3]  (value not drawn)
MH3  MOUNTING HOLE  [M3]  (value not drawn)
MH4  MOUNTING HOLE  [M3]  (value not drawn)
P1  Header 2  [HDR1X2]  (value not drawn)
P2  Header 2  [HDR1X2]  (value not drawn)
P3  Header 2  [HDR1X2]  (value not drawn)
P4  Header 2  [HDR1X2]  (value not drawn)
P5  Header 2  [HDR1X2]  (value not drawn)
P6  Header 2  [HDR1X2]  (value not drawn)
R9  1K  [RES-CHP0402-0.35H]
R10  1K  [RES-CHP0402-0.35H]
R11  22R  [RES-CHP0402-0.35H]
R12  22R  [RES-CHP0402-0.35H]
R13  22R  [RES-CHP0402-0.35H]
R14  22R  [RES-CHP0402-0.35H]
R15  22R  [RES-CHP0402-0.35H]
R16  22R  [RES-CHP0402-0.35H]
R17  22R  [RES-CHP0402-0.35H]
R18  22R  [RES-CHP0402-0.35H]
R19  22R  [RES-CHP0402-0.35H]
R20  22R  [RES-CHP0402-0.35H]
R21  22R  [RES-CHP0402-0.35H]
R22  22R  [RES-CHP0402-0.35H]
R23  22R  [RES-CHP0402-0.35H]
R24  22R  [RES-CHP0402-0.35H]
R25  22R  [RES-CHP0402-0.35H]
R26  22R  [RES-CHP0402-0.35H]
R27  22R  [RES-CHP0402-0.35H]
R28  22R  [RES-CHP0402-0.35H]
R29  22R  [RES-CHP0402-0.35H]
R30  22R  [RES-CHP0402-0.35H]
R31  22R  [RES-CHP0402-0.35H]
R32  22R  [RES-CHP0402-0.35H]
R33  22R  [RES-CHP0402-0.35H]
R34  22R  [RES-CHP0402-0.35H]
R35  22R  [RES-CHP0402-0.35H]
R36  22R  [RES-CHP0402-0.35H]
R37  22R  [RES-CHP0402-0.35H]
R38  22R  [RES-CHP0402-0.35H]
R39  22R  [RES-CHP0402-0.35H]
R40  22R  [RES-CHP0402-0.35H]
R41  22R  [RES-CHP0402-0.35H]
R42  22R  [RES-CHP0402-0.35H]
R43  22R  [RES-CHP0402-0.35H]
R44  22R  [RES-CHP0402-0.35H]
R45  22R  [RES-CHP0402-0.35H]
R46  22R  [RES-CHP0402-0.35H]
R47  1K  [RES-CHP0402-0.35H]
R48  1K  [RES-CHP0402-0.35H]
R49  22R  [RES-CHP0402-0.35H]
R50  22R  [RES-CHP0402-0.35H]
R51  22R  [RES-CHP0402-0.35H]
R52  22R  [RES-CHP0402-0.35H]
R53  22R  [RES-CHP0402-0.35H]
R54  22R  [RES-CHP0402-0.35H]
R55  22R  [RES-CHP0402-0.35H]
R56  22R  [RES-CHP0402-0.35H]
R57  22R  [RES-CHP0402-0.35H]
R58  22R  [RES-CHP0402-0.35H]
R59  22R  [RES-CHP0402-0.35H]
R60  22R  [RES-CHP0402-0.35H]
R61  1K  [RES-CHP0402-0.35H]
R62  1K  [RES-CHP0402-0.35H]
R63  1K  [RES-CHP0402-0.35H]
R64  22R  [RES-CHP0402-0.35H]
R65  22R  [RES-CHP0402-0.35H]
R66  22R  [RES-CHP0402-0.35H]
R67  22R  [RES-CHP0402-0.35H]
R68  22R  [RES-CHP0402-0.35H]
R69  22R  [RES-CHP0402-0.35H]
R70  22R  [RES-CHP0402-0.35H]
R71  22R  [RES-CHP0402-0.35H]
R72  22R  [RES-CHP0402-0.35H]
R73  22R  [RES-CHP0402-0.35H]
R75  22R  [RES-CHP0402-0.35H]
R76  22R  [RES-CHP0402-0.35H]
R78  22R  [RES-CHP0402-0.35H]
R83  22R  [RES-CHP0402-0.35H]
R84  22R  [RES-CHP0402-0.35H]
R86  22R  [RES-CHP0402-0.35H]
R87  22R  [RES-CHP0402-0.35H]
R88  22R  [RES-CHP0402-0.35H]
R93  22R  [RES-CHP0402-0.35H]
R94  10K  [RES-CHP0402-0.35H]
R95  10K  [RES-CHP0402-0.35H]
R96  22R  [RES-CHP0402-0.35H]
R97  22R  [RES-CHP0402-0.35H]
R98  22R  [RES-CHP0402-0.35H]
U4  STM32F427VIT6  [QFP50P1600X1600X160-100N]  (parts A,B,C,D of 4)
U5  STM32F427VIT6  [QFP50P1600X1600X160-100N]  (parts A,B,C,D of 4)
U6  STM32F427VIT6  [QFP50P1600X1600X160-100N]  (parts A,B,C,D of 4)
Y1  C3E-8Mhz  [XTAL_C3E-8.000-8-1015-R]
Y2  ABS07-120-32.768KHZ-T  [XTAL_ABS07-120-32.768KHZ-T]  (value not drawn)
Y3  C3E-8Mhz  [XTAL_C3E-8.000-8-1015-R]
Y4  ABS07-120-32.768KHZ-T  [XTAL_ABS07-120-32.768KHZ-T]  (value not drawn)
Y5  C3E-8Mhz  [XTAL_C3E-8.000-8-1015-R]
Y6  ABS07-120-32.768KHZ-T  [XTAL_ABS07-120-32.768KHZ-T]  (value not drawn)

### Ports
BAROMETER (harness BAROMETER), ICM-42688-P (harness ICM-42688-P), LIS3ML (harness LIS3ML), NEO-M8 (harness NEO-M8), NRST1 (in), NRST2 (in), NRST (in), PYRO (out), PYROC2 (out), RESET_GPS (out), RESET_RF (out), RF MODULE (harness RF MODULE), SDCARD (harness SDCARD), SERVO (harness SERVO), SWD2 (harness SWD2), SWD3 (harness SWD3), SWD (harness SWD), USB2 (harness USB2), USB (harness USB)

### Harnesses
NEO-M8: RX, TX, TIMEPULSE, EXTINT
RF MODULE: USART3_TX, USART3_RX, RST, CTS, ON/SLEEP
ICM-42688-P: IMU_SDI, IMU_SDO, IMU_SCLK, IMU_CS, IMU_INT
USB: D-, D+
BAROMETER: SPI2_MOSI, SPI2_MISO, SPI2_SCK, SPI2_NSS
SDCARD: SD_CLK, SD_DAT3, SD_DAT2, SD_DAT1, SD_DAT0, SD_CMD, SD_DET
LIS3ML: MAG_INT, MAG_SDA, MAG_SDO, MAG_SCL, MAG_CS, MAG_DRDY, MAG_C1
SWD: SWDIO, SWCLK
USB2: D2-, D2+
SERVO: SERVO1, SERVO2, SERVO3, SERVO4, SERVO5, SERVO6
SWD2: SWDIO2, SWCLK2
SWD3: SWDIO3, SWCLK3

### Nets
3.3VA: C18.2 C19.2 C20.2 C21.2 C22.2 C23.2 C24.2 C25.2 C26.2 C27.2 C28.2 C29.2 C35.2 C36.2 C37.2 C38.2 C39.2 C40.2 C41.2 C42.2 C43.2 C44.2 C45.2 C46.2 C52.2 C53.2 C54.2 C55.2 C56.2 C57.2 C58.2 C59.2 C60.2 C61.2 C62.2 C63.2 P1.1 P3.1 P5.1 R9.2 R47.2 R62.2 R94.2 R95.2 U4.6(VBAT) U4.11(VDD) U4.19(VDD) U4.21(VREF+) U4.22(VDDA) U4.28(VDD) U4.49(VCAP_1) U4.50(VDD) U4.73(VCAP_2) U4.75(VDD) U4.100(VDD) U5.6(VBAT) U5.11(VDD) U5.19(VDD) U5.21(VREF+) U5.22(VDDA) U5.28(VDD) U5.49(VCAP_1) U5.50(VDD) U5.73(VCAP_2) U5.75(VDD) U5.100(VDD) U6.6(VBAT) U6.11(VDD) U6.19(VDD) U6.21(VREF+) U6.22(VDDA) U6.28(VDD) U6.49(VCAP_1) U6.50(VDD) U6.73(VCAP_2) U6.75(VDD) U6.100(VDD)
GND: C18.1 C19.1 C20.1 C21.1 C22.1 C23.1 C24.1 C25.1 C26.1 C27.1 C28.1 C29.1 C30.1 C31.1 C32.1 C35.1 C36.1 C37.1 C38.1 C39.1 C40.1 C41.1 C42.1 C43.1 C44.1 C46.1 C47.1 C50.1 C51.1 C52.1 C53.1 C54.1 C55.1 C56.1 C57.1 C58.1 C59.1 C60.1 C61.1 C62.1 C63.1 C64.1 C67.1 C68.1 J1.S1(SHIELD1) J1.S2(SHIELD2) P2.2 P4.2 P6.2 R10.1 R48.1 R61.2 R63.1 U4.10(VSS) U4.20(VSSA) U4.27(VSS) U4.74(VSS) U4.99(VSS) U5.10(VSS) U5.20(VSSA) U5.27(VSS) U5.74(VSS) U5.99(VSS) U6.10(VSS) U6.20(VSSA) U6.27(VSS) U6.74(VSS) U6.99(VSS)
CTS: R18.2 ; port RF MODULE.CTS
EXTINT: R14.2 ; port NEO-M8.EXTINT
IMU_CS: R23.2 ; port ICM-42688-P.IMU_CS
IMU_INT: R24.2 ; port ICM-42688-P.IMU_INT
IMU_SCLK: R22.2 ; port ICM-42688-P.IMU_SCLK
IMU_SDIO: R20.2 ; port ICM-42688-P.IMU_SDI
IMU_SDO: R21.2 ; port ICM-42688-P.IMU_SDO
MAG_C1: R84.1 ; port LIS3ML.MAG_C1
MAG_CS: R35.2 ; port LIS3ML.MAG_CS
MAG_DRDY: R83.1 ; port LIS3ML.MAG_DRDY
MAG_INT: R31.2 ; port LIS3ML.MAG_INT
MAG_SCL: R34.2 ; port LIS3ML.MAG_SCL
MAG_SDA: R32.2 ; port LIS3ML.MAG_SDA
MAG_SDO: R33.2 ; port LIS3ML.MAG_SDO
NRST: C47.2 R47.1 U5.14(~{NRST}) ; port NRST
NRST1: C30.2 R9.1 U4.14(~{NRST}) ; port NRST1
NRST2: C64.2 R62.1 U6.14(~{NRST}) ; port NRST2
ON/SLEEP: R19.2 ; port RF MODULE.ON/SLEEP
PI_MISO: J1.2 R58.2
PI_MOSI: J1.3 R57.2
PI_NSS: J1.1 R59.2
PI_RX: J1.6 R55.2
PI_SCK: J1.4 R56.2
PI_TX: J1.5 R60.1
PYRO: R88.1 ; port PYRO
PYROC2: R93.1 ; port PYROC2
RST: R17.2 ; port RF MODULE.RST
SCL: R64.2 R68.2 R95.1
SD_CLK: R36.2 ; port SDCARD.SD_CLK
SD_CMD: R41.2 ; port SDCARD.SD_CMD
SD_DAT0: R40.2 ; port SDCARD.SD_DAT0
SD_DAT1: R39.2 ; port SDCARD.SD_DAT1
SD_DAT2: R38.2 ; port SDCARD.SD_DAT2
SD_DAT3: R37.2 ; port SDCARD.SD_DAT3
SD_DET: R45.2 ; port SDCARD.SD_DET
SDA: R66.2 R69.2 R94.1
SERVO1: R71.2 ; port SERVO.SERVO1
SERVO2: R72.2 ; port SERVO.SERVO2
SERVO3: R73.2 ; port SERVO.SERVO3
SERVO4: R70.1 ; port SERVO.SERVO4
SERVO5: R65.1 ; port SERVO.SERVO5
SERVO6: R67.1 ; port SERVO.SERVO6
SPI2_MISO: R43.2 ; port BAROMETER.SPI2_MISO
SPI2_MOSI: R42.2 ; port BAROMETER.SPI2_MOSI
SPI2_NSS: R46.2 ; port BAROMETER.SPI2_NSS
SPI2_SCK: R44.2 ; port BAROMETER.SPI2_SCK
SWCLK: R29.2 ; port SWD.SWCLK
SWCLK2: R49.2 ; port SWD2.SWCLK2
SWCLK3: R86.2 ; port SWD3.SWCLK3
SWDIO: R30.2 ; port SWD.SWDIO
SWDIO2: R50.2 ; port SWD2.SWDIO2
SWDIO3: R87.2 ; port SWD3.SWDIO3
TIMEPUL: R13.2 ; port NEO-M8.TIMEPULSE
UART7_Rx: R11.2 ; port NEO-M8.RX
UART7_Rx2: R75.2 R98.2
UART7_Tx: R12.2 ; port NEO-M8.TX
UART7_Tx2: R96.2 R97.2
USART1_RX: R25.2 R54.2
USART1_TX: R26.2 R53.2
USART3_RX: R16.2 ; port RF MODULE.USART3_RX
USART3_TX: R15.2 ; port RF MODULE.USART3_TX
USB2_N: R52.2 ; port USB2.D2-
USB2_P: R51.2 ; port USB2.D2+
USB_N: R28.2 ; port USB.D-
USB_P: R27.2 ; port USB.D+
NetC31_2: C31.2 U4.9(PC15-OSC32_OUT) Y2.2
NetC32_2: C32.2 U4.8(PC14-OSC32_IN) Y2.1
NetC33_1: C33.1 U4.12(PH0-OSC_IN) Y1.3
NetC33_2: C33.2 Y1.2(GND)
NetC34_1: C34.1 U4.13(PH1-OSC_OUT) Y1.1
NetC34_2: C34.2 Y1.4(GND)
NetC48_1: C48.1 U5.12(PH0-OSC_IN) Y3.3
NetC48_2: C48.2 Y3.2(GND)
NetC49_1: C49.1 U5.13(PH1-OSC_OUT) Y3.1
NetC49_2: C49.2 Y3.4(GND)
NetC50_2: C50.2 U5.9(PC15-OSC32_OUT) Y4.2
NetC51_2: C51.2 U5.8(PC14-OSC32_IN) Y4.1
NetC65_1: C65.1 U6.12(PH0-OSC_IN) Y5.3
NetC65_2: C65.2 Y5.2(GND)
NetC66_1: C66.1 U6.13(PH1-OSC_OUT) Y5.1
NetC66_2: C66.2 Y5.4(GND)
NetC67_2: C67.2 U6.9(PC15-OSC32_OUT) Y6.2
NetC68_2: C68.2 U6.8(PC14-OSC32_IN) Y6.1
NetLD3_1: LD3.1(A) U5.56(PD9)
NetLD3_2: LD3.2(K) R61.1
NetP1_2: P1.2 P2.1 R10.2 U4.94(BOOT0)
NetP3_2: P3.2 P4.1 R48.2 U5.94(BOOT0)
NetP5_2: P5.2 P6.1 R63.2 U6.94(BOOT0)
NetR11_1: R11.1 U4.38(PE7)
NetR12_1: R12.1 U4.39(PE8)
NetR13_1: R13.1 U4.40(PE9)
NetR14_1: R14.1 U4.41(PE10)
NetR15_1: R15.1 U4.55(PD8)
NetR16_1: R16.1 U4.56(PD9)
NetR17_1: R17.1 U4.57(PD10)
NetR18_1: R18.1 U4.58(PD11)
NetR19_1: R19.1 U4.59(PD12)
NetR20_1: R20.1 U4.32(PA7)
NetR21_1: R21.1 U4.31(PA6)
NetR22_1: R22.1 U4.30(PA5)
NetR23_1: R23.1 U4.29(PA4)
NetR24_1: R24.1 U4.33(PC4)
NetR25_1: R25.1 U4.69(PA10)
NetR26_1: R26.1 U4.68(PA9)
NetR27_1: R27.1 U4.71(PA12)
NetR28_1: R28.1 U4.70(PA11)
NetR29_1: R29.1 U4.76(PA14(JTCK-SWCLK))
NetR30_1: R30.1 U4.72(PA13(JTMS-SWDIO))
NetR31_1: R31.1 U4.93(PB7)
NetR32_1: R32.1 U4.91(PB5)
NetR33_1: R33.1 U4.90(PB4(NJTRST))
NetR34_1: R34.1 U4.89(PB3(JTDO/TRACESWO))
NetR35_1: R35.1 U4.37(PB2-BOOT1)
NetR36_1: R36.1 U4.80(PC12)
NetR37_1: R37.1 U4.79(PC11)
NetR38_1: R38.1 U4.78(PC10)
NetR39_1: R39.1 U4.66(PC9)
NetR40_1: R40.1 U4.65(PC8)
NetR41_1: R41.1 U4.83(PD2)
NetR42_1: R42.1 U4.54(PB15)
NetR43_1: R43.1 U4.53(PB14)
NetR44_1: R44.1 U4.52(PB13)
NetR45_1: R45.1 U4.7(PC13)
NetR46_1: R46.1 U4.51(PB12)
NetR49_1: R49.1 U5.76(PA14(JTCK-SWCLK))
NetR50_1: R50.1 U5.72(PA13(JTMS-SWDIO))
NetR51_1: R51.1 U5.71(PA12)
NetR52_1: R52.1 U5.70(PA11)
NetR53_1: R53.1 U5.69(PA10)
NetR54_1: R54.1 U5.68(PA9)
NetR55_1: R55.1 U5.93(PB7)
NetR56_1: R56.1 U5.91(PB5)
NetR57_1: R57.1 U5.90(PB4(NJTRST))
NetR58_1: R58.1 U5.89(PB3(JTDO/TRACESWO))
NetR59_1: R59.1 U5.51(PB12)
NetR60_2: R60.2 U5.92(PB6)
NetR64_1: R64.1 U5.47(PB10)
NetR65_2: R65.2 U6.32(PA7)
NetR66_1: R66.1 U5.48(PB11)
NetR67_2: R67.2 U6.31(PA6)
NetR68_1: R68.1 U6.47(PB10)
NetR69_1: R69.1 U6.48(PB11)
NetR70_2: R70.2 U6.93(PB7)
NetR71_1: R71.1 U6.92(PB6)
NetR72_1: R72.1 U6.95(PB8)
NetR73_1: R73.1 U6.96(PB9)
NetR75_1: R75.1 U5.38(PE7)
NetR76_1: R76.1 ; port RESET_GPS
NetR76_2: R76.2 U4.24(PA1)
NetR78_1: R78.1 ; port RESET_RF
NetR78_2: R78.2 U4.25(PA2)
NetR83_2: R83.2 U4.92(PB6)
NetR84_2: R84.2 U4.95(PB8)
NetR86_1: R86.1 U6.76(PA14(JTCK-SWCLK))
NetR87_1: R87.1 U6.72(PA13(JTMS-SWDIO))
NetR88_2: R88.2 U6.65(PC8)
NetR93_2: R93.2 U6.83(PD2)
NetR96_1: R96.1 U6.38(PE7)
NetR97_1: R97.1 U5.39(PE8)
NetR98_1: R98.1 U6.39(PE8)

Not connected (* = marked no-connect by the designer): C45 1; MH1 1(GND)*; MH2 1(GND)*; MH3 1(GND)*; MH4 1(GND)*; U4 1(PE2) 2(PE3) 3(PE4) 4(PE5) 5(PE6) 15(PC0) 16(PC1) 17(PC2) 18(PC3) 23(PA0-WKUP) 26(PA3) 34(PC5) 35(PB0) 36(PB1) 42(PE11) 43(PE12) 44(PE13) 45(PE14) 46(PE15) 47(PB10) 48(PB11) 60(PD13) 61(PD14) 62(PD15) 63(PC6) 64(PC7) 67(PA8) 77(PA15(JTDI)) 81(PD0) 82(PD1) 84(PD3) 85(PD4) 86(PD5) 87(PD6) 88(PD7) 96(PB9) 97(PE0) 98(PE1); U5 1(PE2) 2(PE3) 3(PE4) 4(PE5) 5(PE6) 7(PC13) 15(PC0) 16(PC1) 17(PC2) 18(PC3) 23(PA0-WKUP) 24(PA1) 25(PA2) 26(PA3) 29(PA4) 30(PA5) 31(PA6) 32(PA7) 33(PC4) 34(PC5) 35(PB0) 36(PB1) 37(PB2-BOOT1) 40(PE9)* 41(PE10)* 42(PE11) 43(PE12) 44(PE13) 45(PE14) 46(PE15) 52(PB13) 53(PB14) 54(PB15) 55(PD8)* 57(PD10)* 58(PD11)* 59(PD12)* 60(PD13) 61(PD14) 62(PD15) 63(PC6) 64(PC7) 65(PC8) 66(PC9) 67(PA8) 77(PA15(JTDI)) 78(PC10) 79(PC11) 80(PC12) 81(PD0) 82(PD1) 83(PD2) 84(PD3) 85(PD4) 86(PD5) 87(PD6) 88(PD7) 95(PB8) 96(PB9) 97(PE0) 98(PE1); U6 1(PE2) 2(PE3) 3(PE4) 4(PE5) 5(PE6) 7(PC13) 15(PC0) 16(PC1) 17(PC2) 18(PC3) 23(PA0-WKUP) 24(PA1) 25(PA2) 26(PA3) 29(PA4) 30(PA5) 33(PC4) 34(PC5) 35(PB0) 36(PB1) 37(PB2-BOOT1) 40(PE9)* 41(PE10)* 42(PE11) 43(PE12) 44(PE13) 45(PE14) 46(PE15) 51(PB12) 52(PB13) 53(PB14) 54(PB15) 55(PD8) 56(PD9) 57(PD10) 58(PD11) 59(PD12) 60(PD13) 61(PD14) 62(PD15) 63(PC6) 64(PC7) 66(PC9) 67(PA8) 68(PA9) 69(PA10) 70(PA11) 71(PA12) 77(PA15(JTDI)) 78(PC10) 79(PC11) 80(PC12) 81(PD0) 82(PD1) 84(PD3) 85(PD4) 86(PD5) 87(PD6) 88(PD7) 89(PB3(JTDO/TRACESWO)) 90(PB4(NJTRST)) 91(PB5) 97(PE0) 98(PE1)

### Notes on the sheet
- Labels drawn without touching a wire or pin: GND

### Library data of the parts
C18-C25 C27-C29 C31-C45 C48-C62 C65-C68 = CAPCER0013 100nF 10% 50V X7R 0402 SMD: as C1 on sheet NAVIGATION - POWER; MOUNT: SMD; TMG PN: CAPCER0013; ComponentLink1Description: Datasheet; ComponentLink1URL: https://datasheet.lcsc.com/lcsc/1811021431_Samsung-Electro-Mechanics-CL10B104KB8NNNC_C1591.pdf; Footprint: 0402
C26 C30 C46 C47 C63 C64 = CAPCER0040 10uF 20% 6.3V X5R 0402 SMD: as C2 on sheet NAVIGATION - POWER; MOUNT: SMD; ComponentLink1Description: Datasheet; ComponentLink1URL: https://datasheet.lcsc.com/lcsc/2304140030_YAGEO-CC0402MRX5R5BB106_C105884.pdf; Footprint: 0402
LD3 = LEDIND0005 GRE CLR 2.4V 20mA 0402 SMD: as LD1 on sheet NAVIGATION - POWER; MOUNT: SMD; ComponentLink1Description: Datasheet; ComponentLink1URL: https://datasheet.lcsc.com/lcsc/2102221739_Yongyu-Photoelectric-SZYY0402YG_C434449.pdf
MH1-MH4 = MH
P1-P6 = Header 2: Header, 2-Pin; LatestRevisionDate: 17-Jul-2002; LatestRevisionNote: Re-released for DXP Platform.; Publisher: Altium Limited
R9-R73 R75 R76 R78 R83 R84 R86-R88 R93-R98 = RESCHP0097 100K 1% 0402 SMD: as R2 on sheet NAVIGATION - POWER; MOUNT: SMD; TYPE: EP; ComponentLink1Description: Datasheet; ComponentLink1URL: https://datasheet.lcsc.com/lcsc/2304140030_YAGEO-AC0402FR-0710KL_C144807.pdf
U4-U6 = STM32F427VIT6: ARMÂ® CortexÂ®-M4 STM32F4 Microcontroller IC 32-Bit Single-Core 180MHz 2MB (2M x 8) FLASH 100-LQFP (14x14); MF: STMicroelectronics; SnapEDA_Link: https://www.snapeda.com/parts/STM32F427VIT6/STMicroelectronics/view-part/?ref=snap; Package: LQFP-100 STMicroelectronics; Value: *; MP: STM32F427VIT6; Check_prices: https://www.snapeda.com/parts/STM32F427VIT6/STMicroelectronics/view-part/?ref=eda
Y1 Y3 Y5 = C3E-8.000-8-1015-R: Package: None; Price: None; Value: *; MP: C3E-8.000-8-1015-R; Availability: Unavailable
Y2 Y4 Y6 = ABS07-120-32.768KHZ-T: 32.768 kHz Â±20ppm Crystal 6pF 55 kOhms 2-SMD, No Lead; MF: Abracon; Package: SMD-2 Abracon LLC; Purchase-URL: https://pricing.snapeda.com/search/part/ABS07-120-32.768KHZ-T/?ref=eda; Value: *; Digi-Key_Part_Number: 535-11937-2-ND; SnapEDA_Link: https://www.snapeda.com/parts/ABS07-120-32.768KHZ-T/Abracon+LLC/view-part/?ref=snap; MP: ABS07-120-32.768KHZ-T; Check_prices: https://www.snapeda.com/parts/ABS07-120-32.768KHZ-T/Abracon+LLC/view-part/?ref=eda
J1 = 2035590607: Package: None; Availability: Unavailable; Price: None; MP: 2035590607; Value: *

## Sheet -HISTORY.SchDoc
size A4; SheetNumber: 5; SheetTotal: 5

## Sheet NAVIGATION-PHERIPHERAL.SchDoc
size A3; SheetNumber: 4; SheetTotal: 7
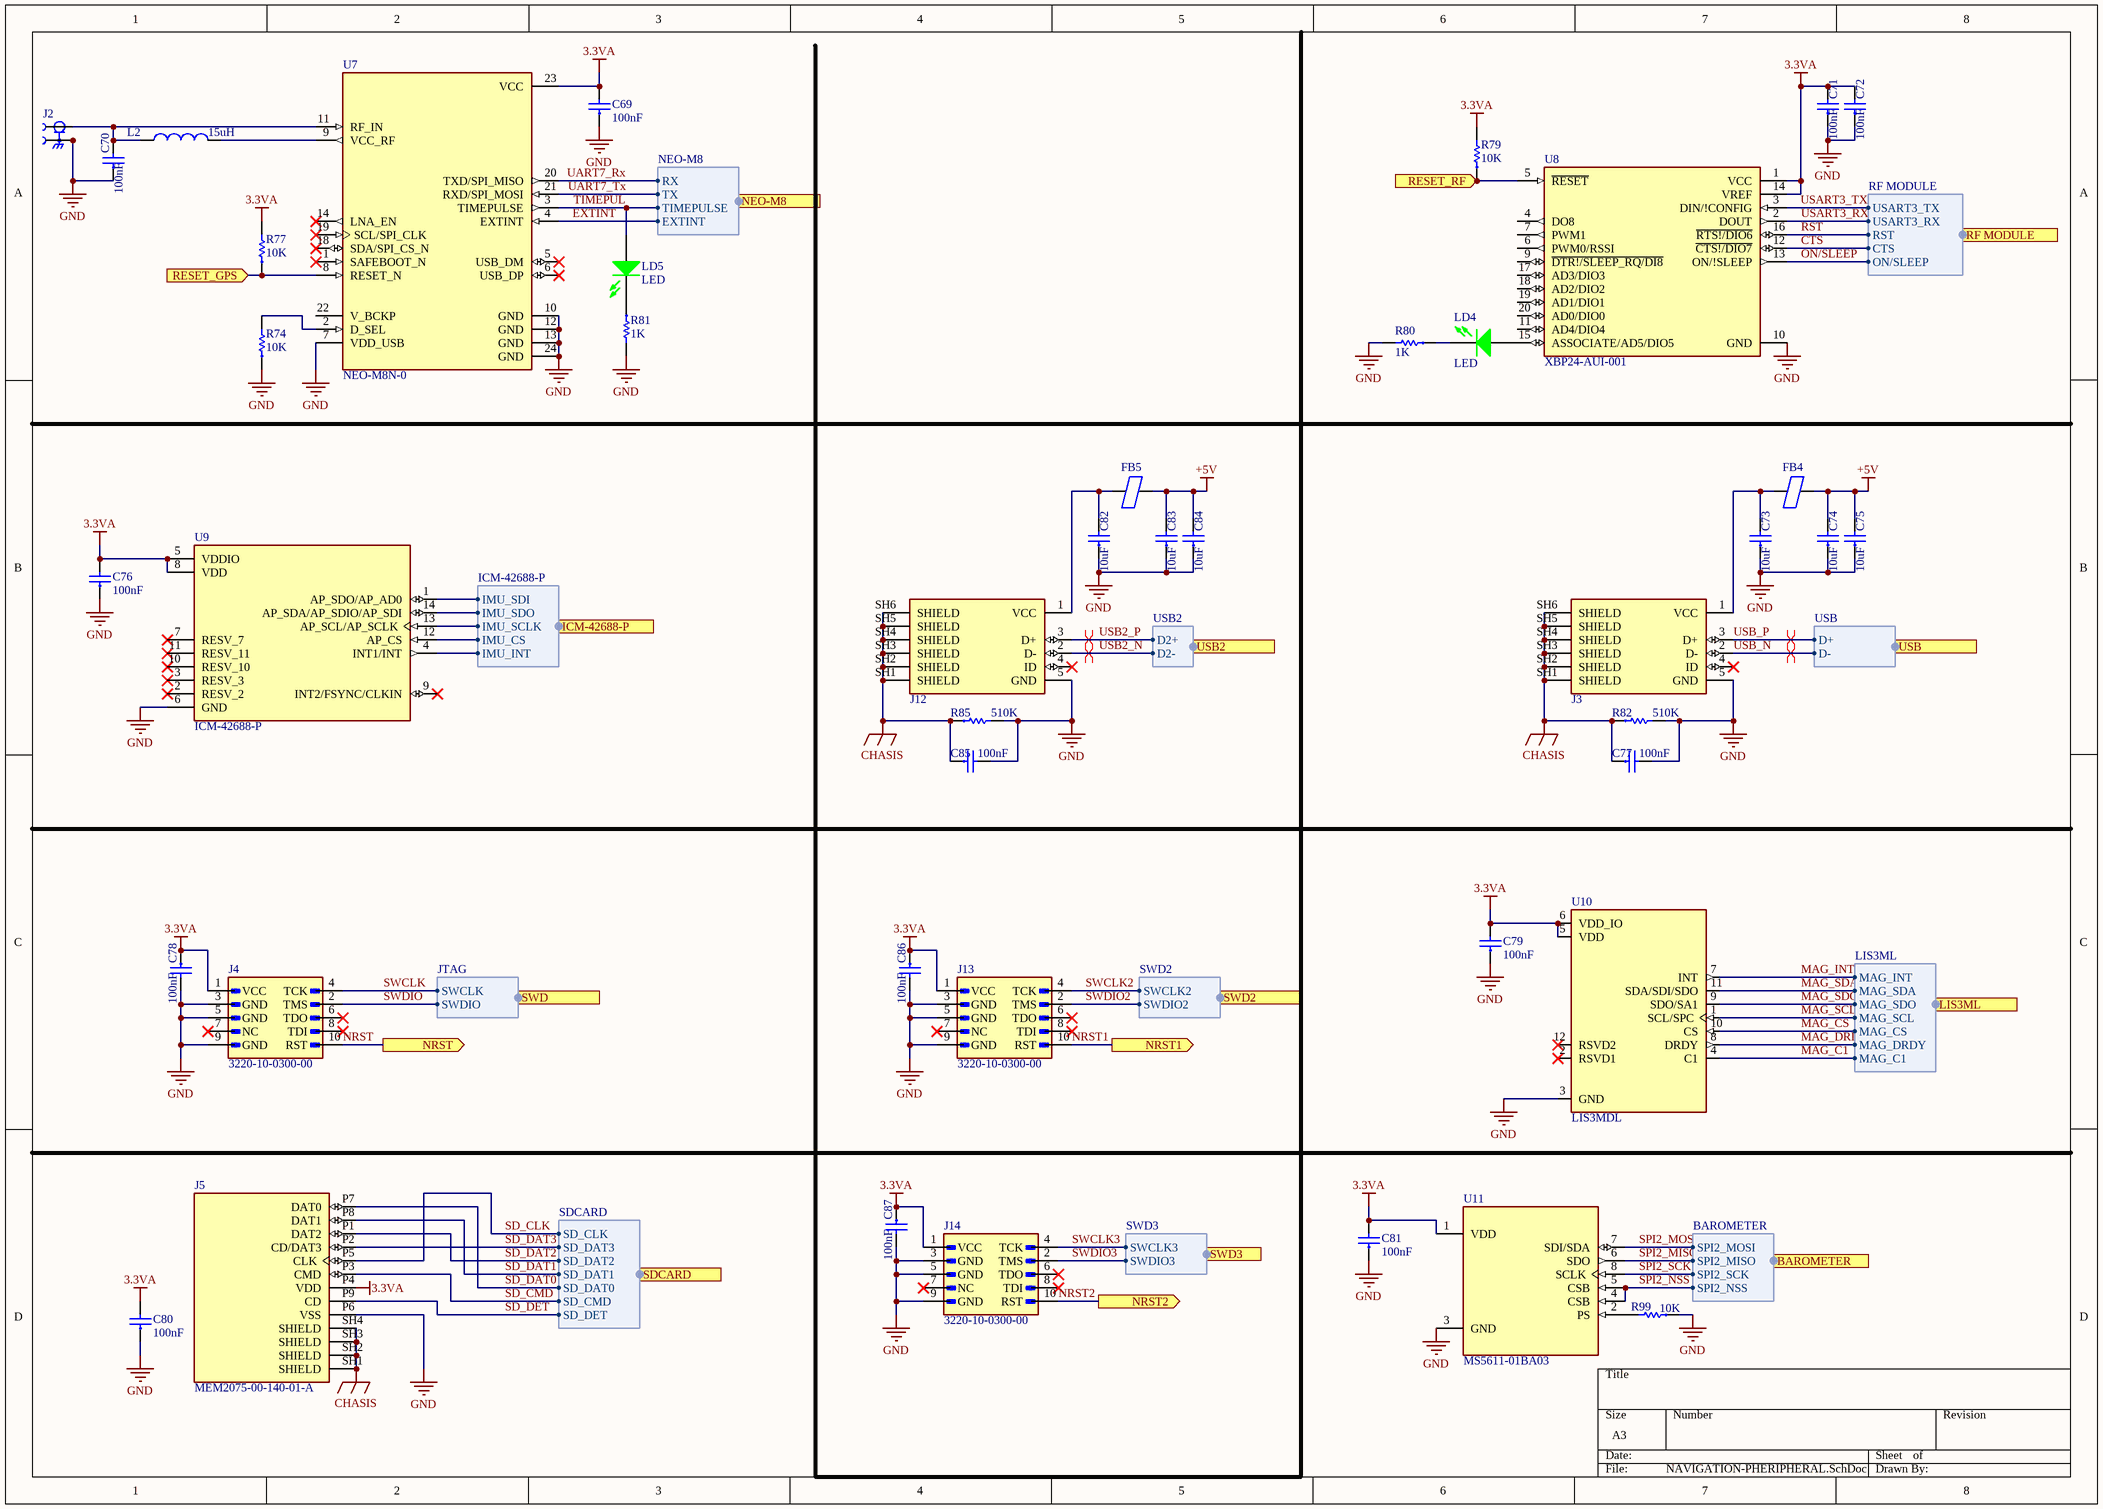
[diagram p5: NAVIGATION-PHERIPHERAL.SchDoc]

### Parts
C69  100nF  [CAP-CER0402-0.5H]
C70  100nF  [CAP-CER0402-0.5H]
C71  100nF  [CAP-CER0402-0.5H]
C72  100nF  [CAP-CER0402-0.5H]
C73  10uF  [CAP-CER0402-20mil]
C74  10uF  [CAP-CER0402-20mil]
C75  10uF  [CAP-CER0402-20mil]
C76  100nF  [CAP-CER0402-0.5H]
C77  100nF  [CAP-CER0603-0.8H]
C78  100nF  [CAP-CER0402-0.5H]
C79  100nF  [CAP-CER0402-0.5H]
C80  100nF  [CAP-CER0402-0.5H]
C81  100nF  [CAP-CER0402-0.5H]
C82  10uF  [CAP-CER0402-20mil]
C83  10uF  [CAP-CER0402-20mil]
C84  10uF  [CAP-CER0402-20mil]
C85  100nF  [CAP-CER0603-0.8H]
C86  100nF  [CAP-CER0402-0.5H]
C87  100nF  [CAP-CER0402-0.5H]
FB4  100MHz 2A 50mOhm  [FB 0603]  (value not drawn)
FB5  100MHz 2A 50mOhm  [FB 0603]  (value not drawn)
J2  CONUFL001-SMD  [LINX_CONUFL001-SMD]  (value not drawn)
J3  MICRO B  [MICRO USB B]  (value not drawn)
J4  3220-10-0300-00  [CNC_3220-10-0300-00]
J5  MEM2075-00-140-01-A  [GCT_MEM2075-00-140-01-A]
J12  MICRO B  [MICRO USB B]  (value not drawn)
J13  3220-10-0300-00  [CNC_3220-10-0300-00]
J14  3220-10-0300-00  [CNC_3220-10-0300-00]
L2  15uH  [INDC1106X70N]
LD4  LED  [LED-IND0402-GRE-0.4H]
LD5  LED  [LED-IND0402-GRE-0.4H]
R74  10K  [RES-CHP0402-0.35H]
R77  10K  [RES-CHP0402-0.35H]
R79  10K  [RES-CHP0402-0.35H]
R80  1K  [RES-CHP0402-0.35H]
R81  1K  [RES-CHP0402-0.35H]
R82  510K  [RES-CHP0402-0.35H]
R85  510K  [RES-CHP0402-0.35H]
R99  10K  [RES-CHP0402-0.35H]
U7  NEO-M8N-0  [XCVR_NEO-M8N-0]
U8  XBP24-AUI-001  [XBP24-AUI-001]
U9  ICM-42688-P  [PQFN50P300X250X97-14N]
U10  LIS3MDL  [XDCR_LIS3MDL]
U11  MS5611-01BA03  [SON125P500X300X100-8N]

### Ports
BAROMETER (harness BAROMETER), ICM-42688-P (harness ICM-42688-P), LIS3ML (harness LIS3ML), NEO-M8 (harness NEO-M8), NRST1 (out), NRST2 (out), NRST (out), RESET_GPS (in), RESET_RF (in), RF MODULE (harness RF MODULE), SDCARD (harness SDCARD), SWD2 (harness SWD2), SWD3 (harness SWD3), SWD (harness JTAG), USB2 (harness USB2), USB (harness USB)

### Harnesses
NEO-M8: RX, TX, TIMEPULSE, EXTINT
RF MODULE: USART3_TX, USART3_RX, RST, CTS, ON/SLEEP
ICM-42688-P: IMU_SDI, IMU_SDO, IMU_SCLK, IMU_CS, IMU_INT
USB: D-, D+
LIS3ML: MAG_INT, MAG_SDA, MAG_SDO, MAG_SCL, MAG_CS, MAG_DRDY, MAG_C1
BAROMETER: SPI2_MOSI, SPI2_MISO, SPI2_SCK, SPI2_NSS
SDCARD: SD_CLK, SD_DAT3, SD_DAT2, SD_DAT1, SD_DAT0, SD_CMD, SD_DET
USB2: D2-, D2+
JTAG: SWDIO, SWCLK
SWD2: SWDIO2, SWCLK2
SWD3: SWDIO3, SWCLK3

### Nets
3.3VA: C69.2 C71.2 C72.2 C76.2 C78.1 C79.2 C80.2 C81.2 C86.1 C87.1 J4.1(VCC) J5.P4(VDD) J13.1(VCC) J14.1(VCC) R77.2 R79.2 U7.23(VCC) U8.1(VCC) U8.14(VREF) U9.5(VDDIO) U9.8(VDD) U10.5(VDD) U10.6(VDD_IO) U11.1(VDD)
+5V: C74.2 C75.2 C83.2 C84.2 FB4.2 FB5.2
CHASIS: C77.1 C85.1 J3.SH1(SHIELD) J3.SH2(SHIELD) J3.SH3(SHIELD) J3.SH4(SHIELD) J3.SH5(SHIELD) J3.SH6(SHIELD) J5.SH1(SHIELD) J5.SH2(SHIELD) J5.SH3(SHIELD) J5.SH4(SHIELD) J12.SH1(SHIELD) J12.SH2(SHIELD) J12.SH3(SHIELD) J12.SH4(SHIELD) J12.SH5(SHIELD) J12.SH6(SHIELD) R82.1 R85.1
GND: C69.1 C70.1 C71.1 C72.1 C73.1 C74.1 C75.1 C76.1 C77.2 C78.2 C79.1 C80.1 C81.1 C82.1 C83.1 C84.1 C85.2 C86.2 C87.2 J2.2 J2.3 J3.5(GND) J4.3(GND) J4.5(GND) J4.9(GND) J5.P6(VSS) J12.5(GND) J13.3(GND) J13.5(GND) J13.9(GND) J14.3(GND) J14.5(GND) J14.9(GND) R74.1 R80.2 R81.2 R82.2 R85.2 R99.1 U7.7(VDD_USB) U7.10(GND) U7.12(GND) U7.13(GND) U7.24(GND) U8.10(GND) U9.6(GND) U10.3(GND) U11.3(GND)
CTS: U8.12(~{CTS!/DIO7}) ; port RF MODULE.CTS
EXTINT: U7.4(EXTINT) ; port NEO-M8.EXTINT
IMU_CS: U9.12(AP_CS) ; port ICM-42688-P.IMU_CS
IMU_INT: U9.4(INT1/INT) ; port ICM-42688-P.IMU_INT
IMU_SCLK: U9.13(AP_SCL/AP_SCLK) ; port ICM-42688-P.IMU_SCLK
IMU_SDIO: U9.1(AP_SDO/AP_AD0) ; port ICM-42688-P.IMU_SDI
IMU_SDO: U9.14(AP_SDA/AP_SDIO/AP_SDI) ; port ICM-42688-P.IMU_SDO
MAG_C1: U10.4(C1) ; port LIS3ML.MAG_C1
MAG_CS: U10.10(CS) ; port LIS3ML.MAG_CS
MAG_DRDY: U10.8(DRDY) ; port LIS3ML.MAG_DRDY
MAG_INT: U10.7(INT) ; port LIS3ML.MAG_INT
MAG_SCL: U10.1(SCL/SPC) ; port LIS3ML.MAG_SCL
MAG_SDA: U10.11(SDA/SDI/SDO) ; port LIS3ML.MAG_SDA
MAG_SDO: U10.9(SDO/SA1) ; port LIS3ML.MAG_SDO
NRST: J4.10(RST) ; port NRST
NRST1: J13.10(RST) ; port NRST1
NRST2: J14.10(RST) ; port NRST2
ON/SLEEP: U8.13(ON/!SLEEP) ; port RF MODULE.ON/SLEEP
RST: U8.16(~{RTS!/DIO6}) ; port RF MODULE.RST
SD_CLK: J5.P5(CLK) ; port SDCARD.SD_CLK
SD_CMD: J5.P3(CMD) ; port SDCARD.SD_CMD
SD_DAT0: J5.P7(DAT0) ; port SDCARD.SD_DAT0
SD_DAT1: J5.P8(DAT1) ; port SDCARD.SD_DAT1
SD_DAT2: J5.P1(DAT2) ; port SDCARD.SD_DAT2
SD_DAT3: J5.P2(CD/DAT3) ; port SDCARD.SD_DAT3
SD_DET: J5.P9(CD) ; port SDCARD.SD_DET
SPI2_MISO: U11.6(SDO) ; port BAROMETER.SPI2_MISO
SPI2_MOSI: U11.7(SDI/SDA) ; port BAROMETER.SPI2_MOSI
SPI2_NSS: U11.4(CSB) U11.5(CSB) ; port BAROMETER.SPI2_NSS
SPI2_SCK: U11.8(SCLK) ; port BAROMETER.SPI2_SCK
SWCLK: J4.4(TCK) ; port SWD.SWCLK
SWCLK2: J13.4(TCK) ; port SWD2.SWCLK2
SWCLK3: J14.4(TCK) ; port SWD3.SWCLK3
SWDIO: J4.2(TMS) ; port SWD.SWDIO
SWDIO2: J13.2(TMS) ; port SWD2.SWDIO2
SWDIO3: J14.2(TMS) ; port SWD3.SWDIO3
TIMEPUL: LD5.1(A) U7.3(TIMEPULSE) ; port NEO-M8.TIMEPULSE
UART7_Rx: U7.20(TXD/SPI_MISO) ; port NEO-M8.RX
UART7_Tx: U7.21(RXD/SPI_MOSI) ; port NEO-M8.TX
USART3_RX: U8.2(DOUT) ; port RF MODULE.USART3_RX
USART3_TX: U8.3(DIN/!CONFIG) ; port RF MODULE.USART3_TX
USB2_N: J12.2(D-) ; port USB2.D2-
USB2_P: J12.3(D+) ; port USB2.D2+
USB_N: J3.2(D-) ; port USB.D-
USB_P: J3.3(D+) ; port USB.D+
NetC70_2: C70.2 J2.1 L2.1 U7.11(RF_IN)
NetC73_2: C73.2 FB4.1 J3.1(VCC)
NetC82_2: C82.2 FB5.1 J12.1(VCC)
NetL2_2: L2.2 U7.9(VCC_RF)
NetLD4_1: LD4.1(A) U8.15(ASSOCIATE/AD5/DIO5)
NetLD4_2: LD4.2(K) R80.1
NetLD5_2: LD5.2(K) R81.1
NetR74_2: R74.2 U7.2(D_SEL)
NetR76_1: R77.1 U7.8(RESET_N) ; port RESET_GPS
NetR78_1: R79.1 U8.5(~{RESET}) ; port RESET_RF
NetR99_2: R99.2 U11.2(PS)

Not connected (* = marked no-connect by the designer): J3 4(ID)*; J4 6(TDO)* 7(NC)* 8(TDI)*; J12 4(ID)*; J13 6(TDO)* 7(NC)* 8(TDI)*; J14 6(TDO)* 7(NC)* 8(TDI)*; U7 1(SAFEBOOT_N)* 5(USB_DM)* 6(USB_DP)* 14(LNA_EN)* 18(SDA/SPI_CS_N)* 19(SCL/SPI_CLK)* 22(V_BCKP); U8 4(DO8) 6(PWM0/RSSI) 7(PWM1) 9(~{DTR!/SLEEP_RQ/DI8}) 11(AD4/DIO4) 17(AD3/DIO3) 18(AD2/DIO2) 19(AD1/DIO1) 20(AD0/DIO0); U9 2(RESV_2)* 3(RESV_3)* 7(RESV_7)* 9(INT2/FSYNC/CLKIN)* 10(RESV_10)* 11(RESV_11)*; U10 2(RSVD1)* 12(RSVD2)*

### Layout directives
differential pair: USB2_N, USB2_P, USB_N, USB_P

### Library data of the parts
C69-C72 C76 C78-C81 C86 C87 = CAPCER0013 100nF 10% 50V X7R 0402 SMD: as C1 on sheet NAVIGATION - POWER; MOUNT: SMD; TMG PN: CAPCER0013; ComponentLink1Description: Datasheet; ComponentLink1URL: https://datasheet.lcsc.com/lcsc/1811021431_Samsung-Electro-Mechanics-CL10B104KB8NNNC_C1591.pdf; Footprint: 0402
C73-C75 C82-C84 = CAPCER0040 10uF 20% 6.3V X5R 0402 SMD: as C2 on sheet NAVIGATION - POWER; MOUNT: SMD; ComponentLink1Description: Datasheet; ComponentLink1URL: https://datasheet.lcsc.com/lcsc/2304140030_YAGEO-CC0402MRX5R5BB106_C105884.pdf; Footprint: 0402
C77 C85 = CAPCER0001 100nF 10% 50V X7R 0603 SMD: CAP CER 100nF 10% 50V X7R 0603 SMD; LINE: SMT; TYPE: EP; UNIT: PCS; TMG CODE: None; CERTIFICATION: NA; CLASS: B; MOUNT: SMD; TMG PN: CAPCER0001; ComponentLink1Description: Datasheet; ComponentLink1URL: https://datasheet.lcsc.com/lcsc/1811021431_Samsung-Electro-Mechanics-CL10B104KB8NNNC_C1591.pdf; Footprint: 0603
FB4 FB5 = BLM18PG121SN1D: as FB1 on sheet NAVIGATION - POWER; Supplier 1: Mouser; Manufacturer Part Number: BLM18PG121SN1D; RoHS: Yes; Category: Ferrite Beads and Chips; Stock 1: 377848; Pricing 1: 1=0.1, 10=0.059, 50=0.047, 100=0.042, 1000=0.029, 10000=0.018 (USD); Case/Package: 0603; Number of Pins: 2; Core Material: Ferrite; Case Code (Metric): 1608; Case Code (Imperial): 0603; Min Operating Temperature: -55°C; Max Operating Temperature: 125°C; Tolerance: 25%; Package Quantity: 1; Max Current Rating: 2A; Packaging: Tape and Reel; Current Rating: 2A; Max DC Current: 2A; Termination: SMD/SMT; Test Frequency: 100MHz; DC Current: 2A; Frequency: 100MHz; Series: BLM18P; DC Resistance-Max: 50mR; RMS Current (Irms): 2A; Series Resistance: 50mR; Length: 1.6mm; Width: 0.8mm; Height: 0.8mm; Depth: 0.8mm; Radiation Hardening: No; Reach SVHC Compliant: No; Lead Free: Lead Free; RoHS Compliant: Yes; ComponentLink1URL: https://datasheet.ciiva.com/5709/1740433-5709171.pdf?src-supplier=Farnell; ComponentLink1Description: https://datasheet.ciiva.com/5709/1740433-5709171.pdf?src-supplier=Farnell; ComponentLink2URL: https://datasheet.ciiva.com/19454/1845013-19454715.pdf?src-supplier=Jameco; ComponentLink2Description: https://datasheet.ciiva.com/19454/1845013-19454715.pdf?src-supplier=Jameco; ComponentLink3URL: https://datasheet.ciiva.com/11799/0900766b81275ca5-11799546.pdf?src-supplier=Rs; ComponentLink3Description: https://datasheet.ciiva.com/11799/0900766b81275ca5-11799546.pdf?src-supplier=Rs; ComponentLink4URL: https://datasheet.ciiva.com/3854/5emiapbde-1-3854039.pdf?src-supplier=Arrow+Electronics; ComponentLink4Description: https://datasheet.ciiva.com/3854/5emiapbde-1-3854039.pdf?src-supplier=Arrow+Electronics; ComponentLink5URL: https://datasheet.ciiva.com/29347/442365-da-01-en-chip-drossel-0603-120r-2000ma-1-6x0-8mm-29347911.pdf?src-supplier=Conrad; ComponentLink5Description: https://datasheet.ciiva.com/29347/442365-da-01-en-chip-drossel-0603-120r-2000ma-1-6x0-8mm-29347911.pdf?src-supplier=Conrad; ComponentLink6URL: https://datasheet.ciiva.com/8021/1740433-8021493.pdf?src-supplier=Element14; ComponentLink6Description: https://datasheet.ciiva.com/8021/1740433-8021493.pdf?src-supplier=Element14; ComponentLink7URL: https://datasheet.ciiva.com/8021/1740433-8021494.pdf?src-supplier=Element14; ComponentLink7Description: https://datasheet.ciiva.com/8021/1740433-8021494.pdf?src-supplier=Element14; ComponentLink8URL: https://datasheet.ciiva.com/14122/blm-series-eng-tds-14122905.pdf?src-supplier=Distrelec; ComponentLink8Description: https://datasheet.ciiva.com/14122/blm-series-eng-tds-14122905.pdf?src-supplier=Distrelec; ComponentLink9URL: https://datasheet.ciiva.com/6212/l0110s0100blm18p-6212502.pdf?src-supplier=Digikey; ComponentLink9Description: https://datasheet.ciiva.com/6212/l0110s0100blm18p-6212502.pdf?src-supplier=Digikey; ComponentLink10URL: https://datasheet.ciiva.com/6212/l0110s0100blm18p-6212504.pdf?src-supplier=Digikey; ComponentLink10Description: https://datasheet.ciiva.com/6212/l0110s0100blm18p-6212504.pdf?src-supplier=Digikey; ComponentLink11URL: https://datasheet.ciiva.com/3081/l0110s0100blm18p-3081632.pdf?src-supplier=Avnet; ComponentLink11Description: https://datasheet.ciiva.com/3081/l0110s0100blm18p-3081632.pdf?src-supplier=Avnet; ComponentLink12URL: https://datasheet.ciiva.com/41449/001172297-da-01-en-drossel-0603-120r-1-6x0-8mm-4000st-41449659.pdf?src-supplier=Conrad; ComponentLink12Description: https://datasheet.ciiva.com/41449/001172297-da-01-en-drossel-0603-120r-1-6x0-8mm-4000st-41449659.pdf?src-supplier=Conrad; Supplier Part Number 1: 81-BLM18PG121SN1D
J2 = CONUFL001-SMD: MF: Linx; Availability: In Stock; Price: None; SnapEDA_Link: https://www.snapeda.com/parts/CONUFL001-SMD/Linx/view-part/5842340/?ref=snap; Value: *; Check_prices: https://www.snapeda.com/parts/CONUFL001-SMD/Linx/view-part/5842340/?ref=eda; MP: CONUFL001-SMD; Package: None
J3 J12 = MICRO USB B
J4 J13 J14 = 3220-10-0300-00: Connector Header Surface Mount 10 position 0.050 (1.27mm); MF: CNC Tech; SnapEDA_Link: https://www.snapeda.com/parts/3220-10-0300-00/CNC+Tech/view-part/?ref=snap; Package: None; Value: *; MP: 3220-10-0300-00; Check_prices: https://www.snapeda.com/parts/3220-10-0300-00/CNC+Tech/view-part/?ref=eda
J5 = MEM2075-00-140-01-A: 9 (8 + 1) Position Card Connector microSD Surface Mount, Right Angle Gold; MF: Global Connector Technology; SnapEDA_Link: https://www.snapeda.com/parts/MEM2075-00-140-01-A/Global+Connector+Technology/view-part/?ref=snap; Package: None; Value: *; MP: MEM2075-00-140-01-A; Check_prices: https://www.snapeda.com/parts/MEM2075-00-140-01-A/Global+Connector+Technology/view-part/?ref=eda
L2 = LQW15DN100M00D: MF: {'manufacturer': u'Murata Electronics'}; Package: None; Price: None; Value: *; MP: LQW15DN100M00D; Availability: Unavailable
LD4 LD5 = LEDIND0005 GRE CLR 2.4V 20mA 0402 SMD: as LD1 on sheet NAVIGATION - POWER; MOUNT: SMD; ComponentLink1Description: Datasheet; ComponentLink1URL: https://datasheet.lcsc.com/lcsc/2102221739_Yongyu-Photoelectric-SZYY0402YG_C434449.pdf
R74 R77 R79 = RESCHP0073 10K 1% 0402 SMD: as R1 on sheet NAVIGATION - POWER; MOUNT: SMD; TYPE: EP; TMG PN: RESCHP0073; ComponentLink1Description: Datasheet; ComponentLink1URL: https://datasheet.lcsc.com/lcsc/2304140030_YAGEO-AC0402FR-0710KL_C144807.pdf; Footprint: 0402
R80 R81 R99 = RESCHP0097 100K 1% 0402 SMD: as R2 on sheet NAVIGATION - POWER; MOUNT: SMD; TYPE: EP; ComponentLink1Description: Datasheet; ComponentLink1URL: https://datasheet.lcsc.com/lcsc/2304140030_YAGEO-AC0402FR-0710KL_C144807.pdf
R82 R85 = RESCHP0114 510K 1% 0402 SMD: RES CHP 510K 1% 1/16W 0402 SMD; LINE: SMT; UNIT: PCS; TMG CODE: None; CERTIFICATION: NA; CLASS: B; MOUNT: SMD; TYPE: EP; ComponentLink1Description: Datasheet; ComponentLink1URL: https://datasheet.lcsc.com/lcsc/2304140030_YAGEO-RC0402FR-07510KL_C137961.pdf
U7 = NEO-M8N-0: series RF Receiver BeiDou, Galileo, GLONASS, GNSS, GPS 1.575GHz -167dBm - - -; MF: U-Blox America; SnapEDA_Link: https://www.snapeda.com/parts/NEO-M8N-0/u-blox/view-part/?ref=snap; Package: SMD-24 U-Blox America Inc.; Value: *; MP: NEO-M8N-0; Check_prices: https://www.snapeda.com/parts/NEO-M8N-0/u-blox/view-part/?ref=eda
U8 = XBP24-AUI-001: Xbee-Pro 802.15.4, 63mw, Wire Antenna, 250000 Bps; Higher Tran; Package: None; Price: None; Value: *; MP: XBP24-AUI-001; Availability: Unavailable
U9 = ICM-42688-P: Accelerometer, Gyroscope, 6 Axis Sensor Output; Package: None; MP: ICM-42688-P; Value: *; Availability: Unavailable; Price: None
U10 = LIS3MDL: Magnetoresistive Sensor X, Y, Z Axis 12-LGA (2x2); MF: STMicroelectronics; SnapEDA_Link: https://www.snapeda.com/parts/LIS3MDL/STMicroelectronics/view-part/?ref=snap; Package: VFLGA-12 STMicroelectronics; Value: *; MP: LIS3MDL; Check_prices: https://www.snapeda.com/parts/LIS3MDL/STMicroelectronics/view-part/?ref=eda
U11 = MS5611-01BA03: Pressure Sensor 0.15PSI ~ 17.4PSI (1kPa ~ 120kPa) Absolute - 24 b 8-SMD; MF: TE Connectivity; Package: SMD-8 Measurement Specialties; Price: None; Value: *; SnapEDA_Link: https://www.snapeda.com/parts/MS5611-01BA03/TE+Connectivity+ALCOSWITCH+Switches/view-part/?ref=snap; MP: MS5611-01BA03; Availability: Not in stock; Check_prices: https://www.snapeda.com/parts/MS5611-01BA03/TE+Connectivity+ALCOSWITCH+Switches/view-part/?ref=eda